# EasyEDA schematic soap-disp-20210518.json

## Sheets
1 Computer: TITLE: Sheet_1; REV: 1.0; Date: 2021-03-28; Sheet: 1/1; Drawn By: Suresh Kumar Gadi; Company: Your Company
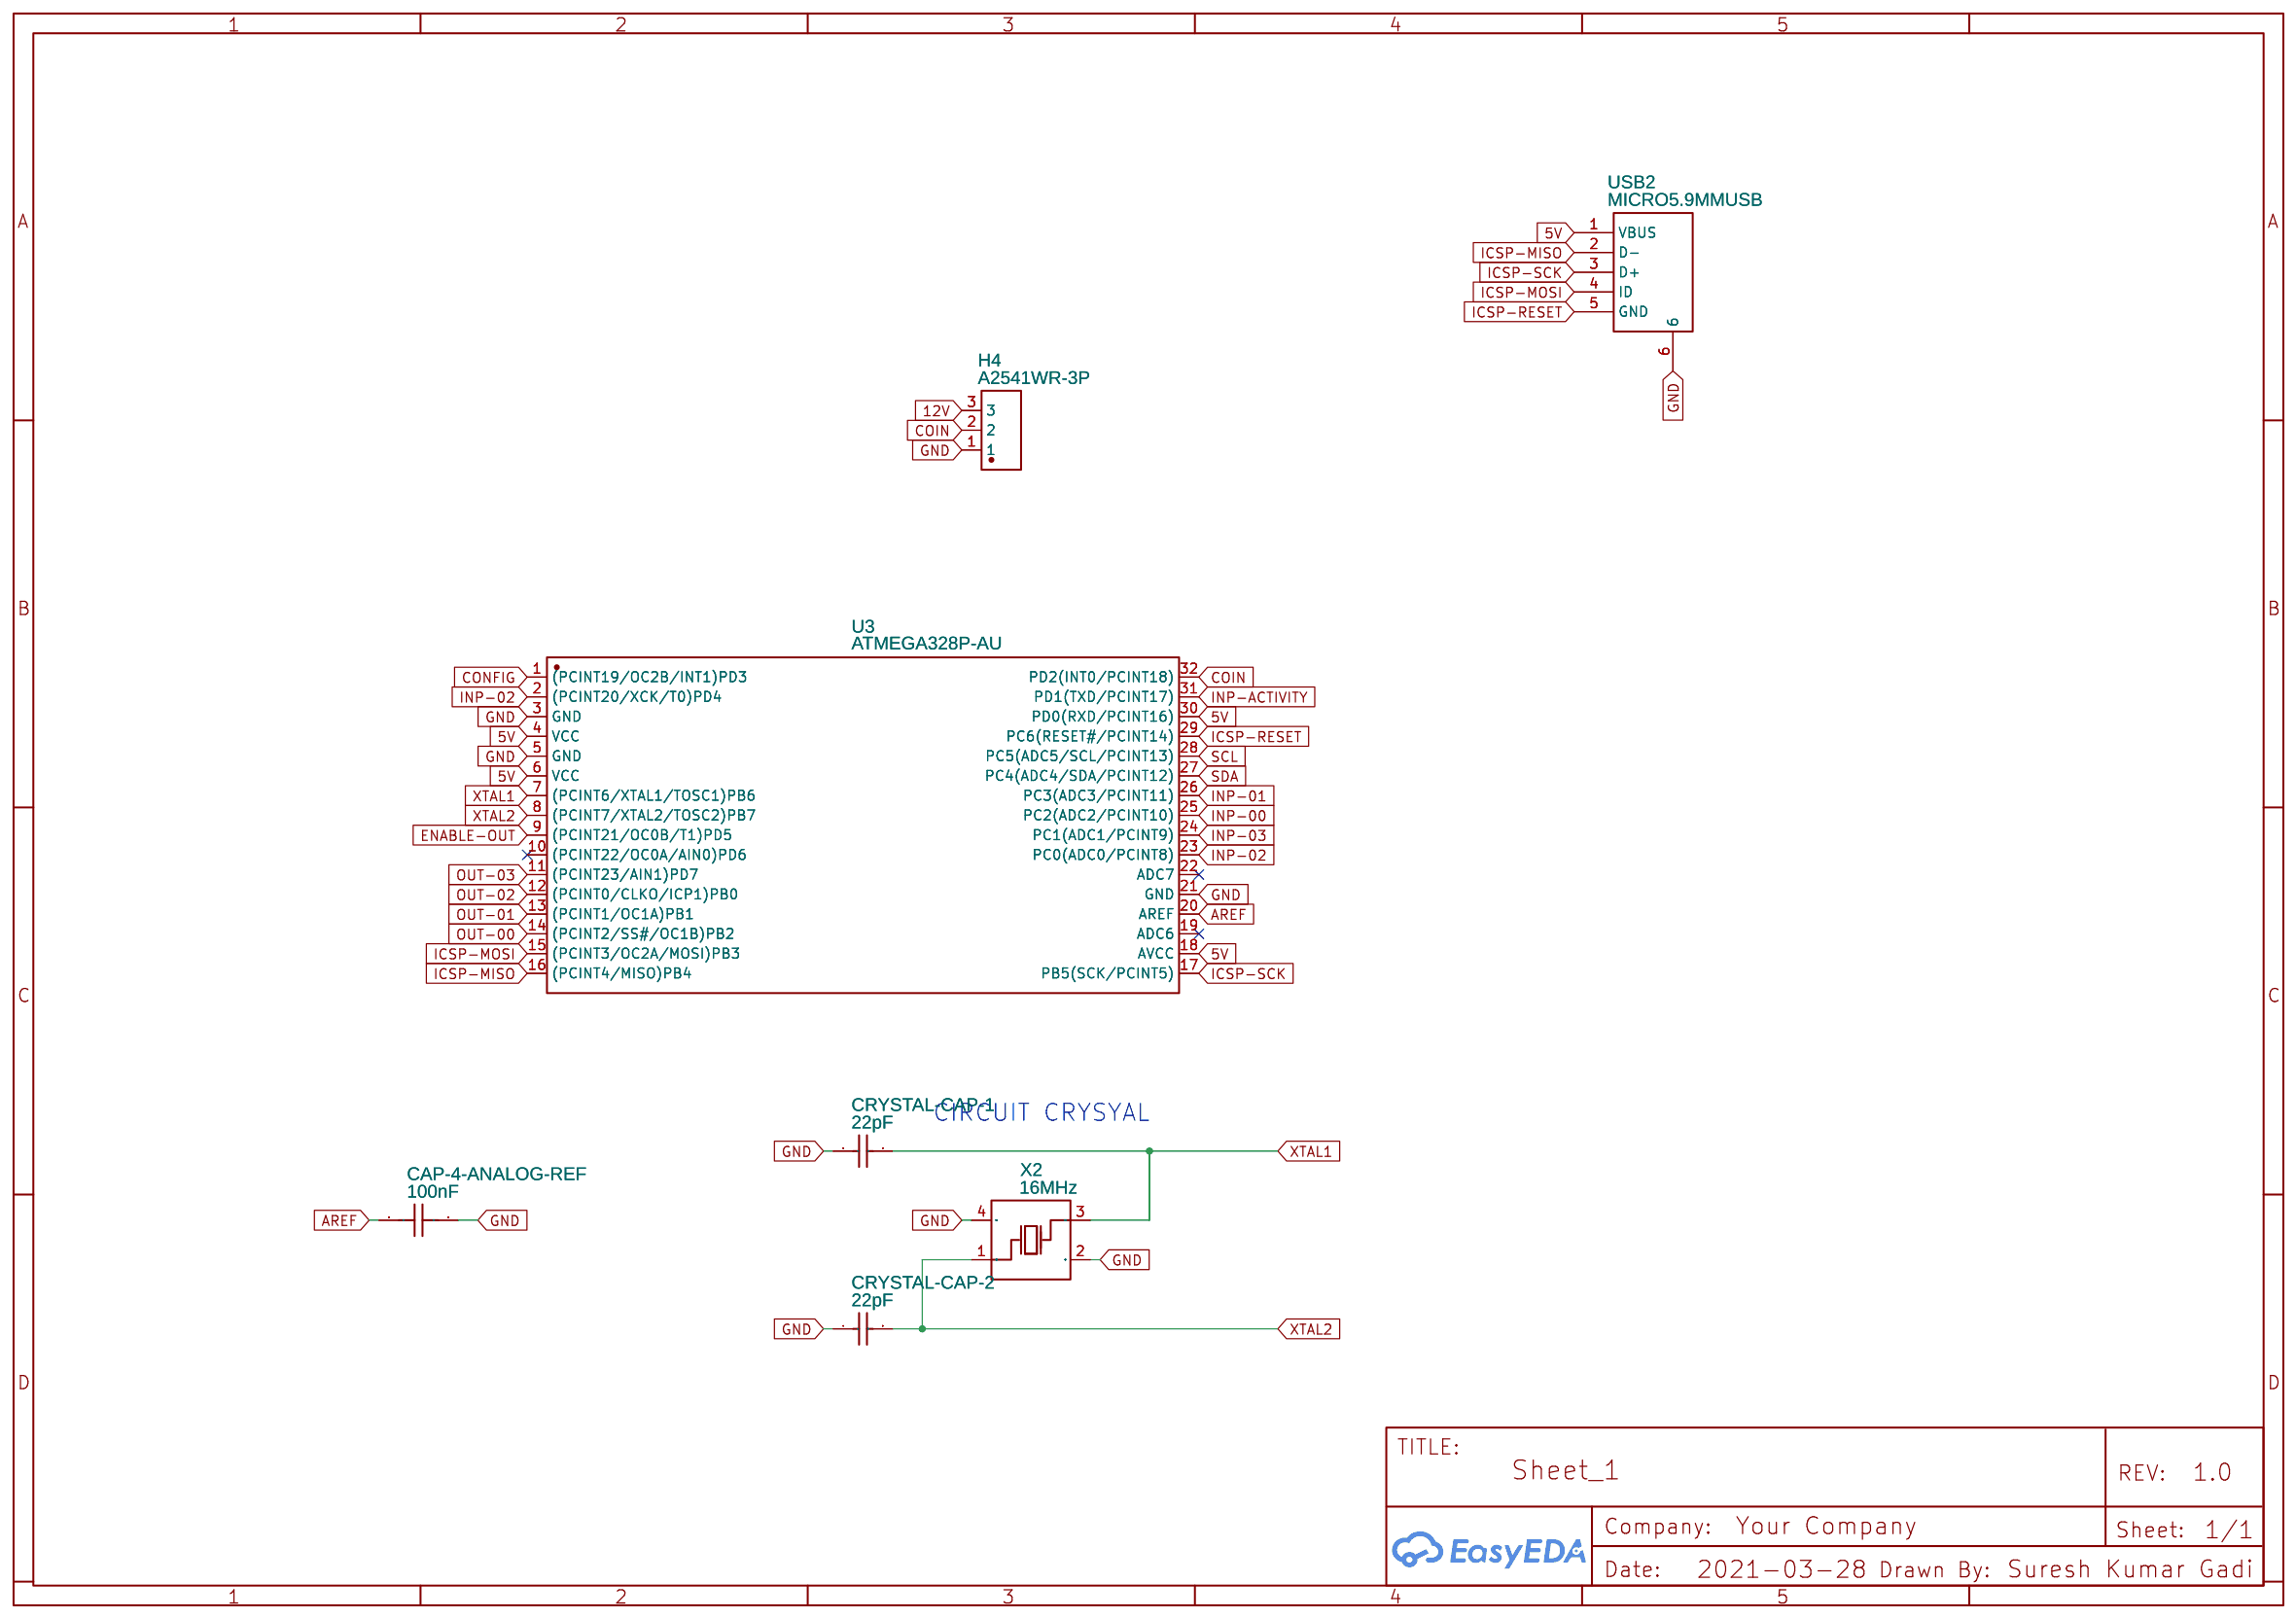
[diagram p0: Computer]
2 Relays: TITLE: Sheet_2
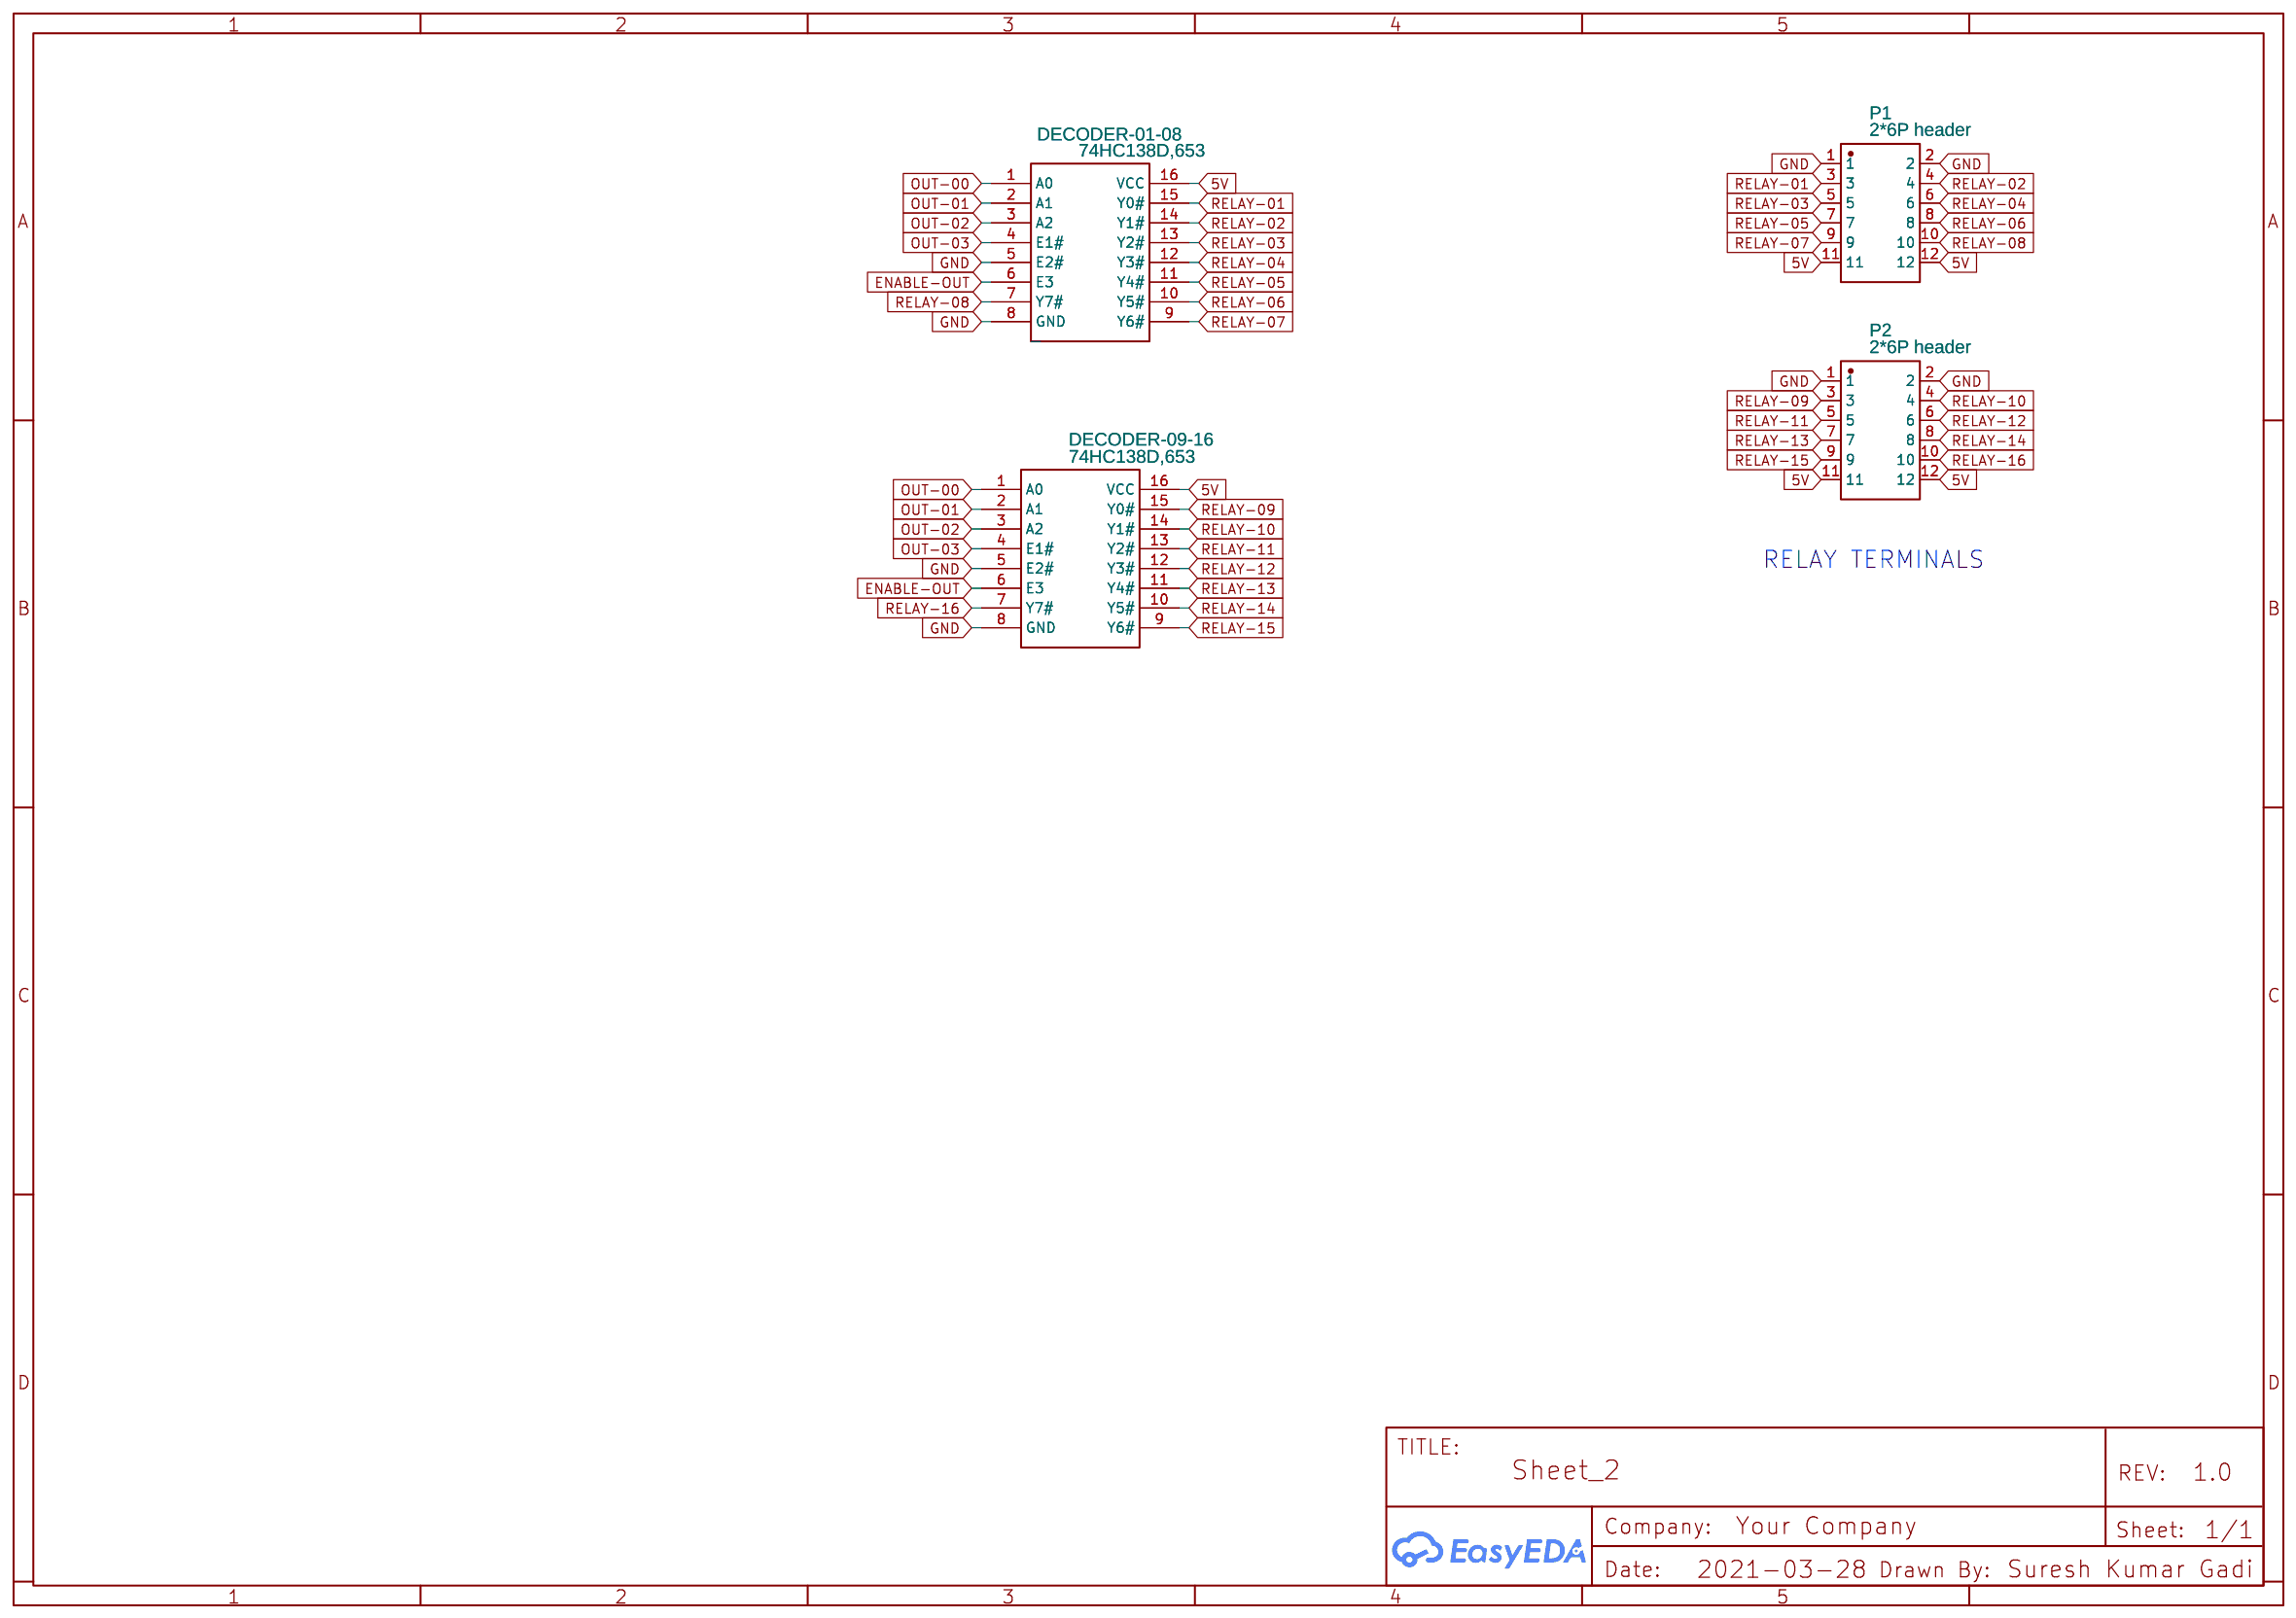
[diagram p1: Relays]
3 Buttons: TITLE: Sheet_2
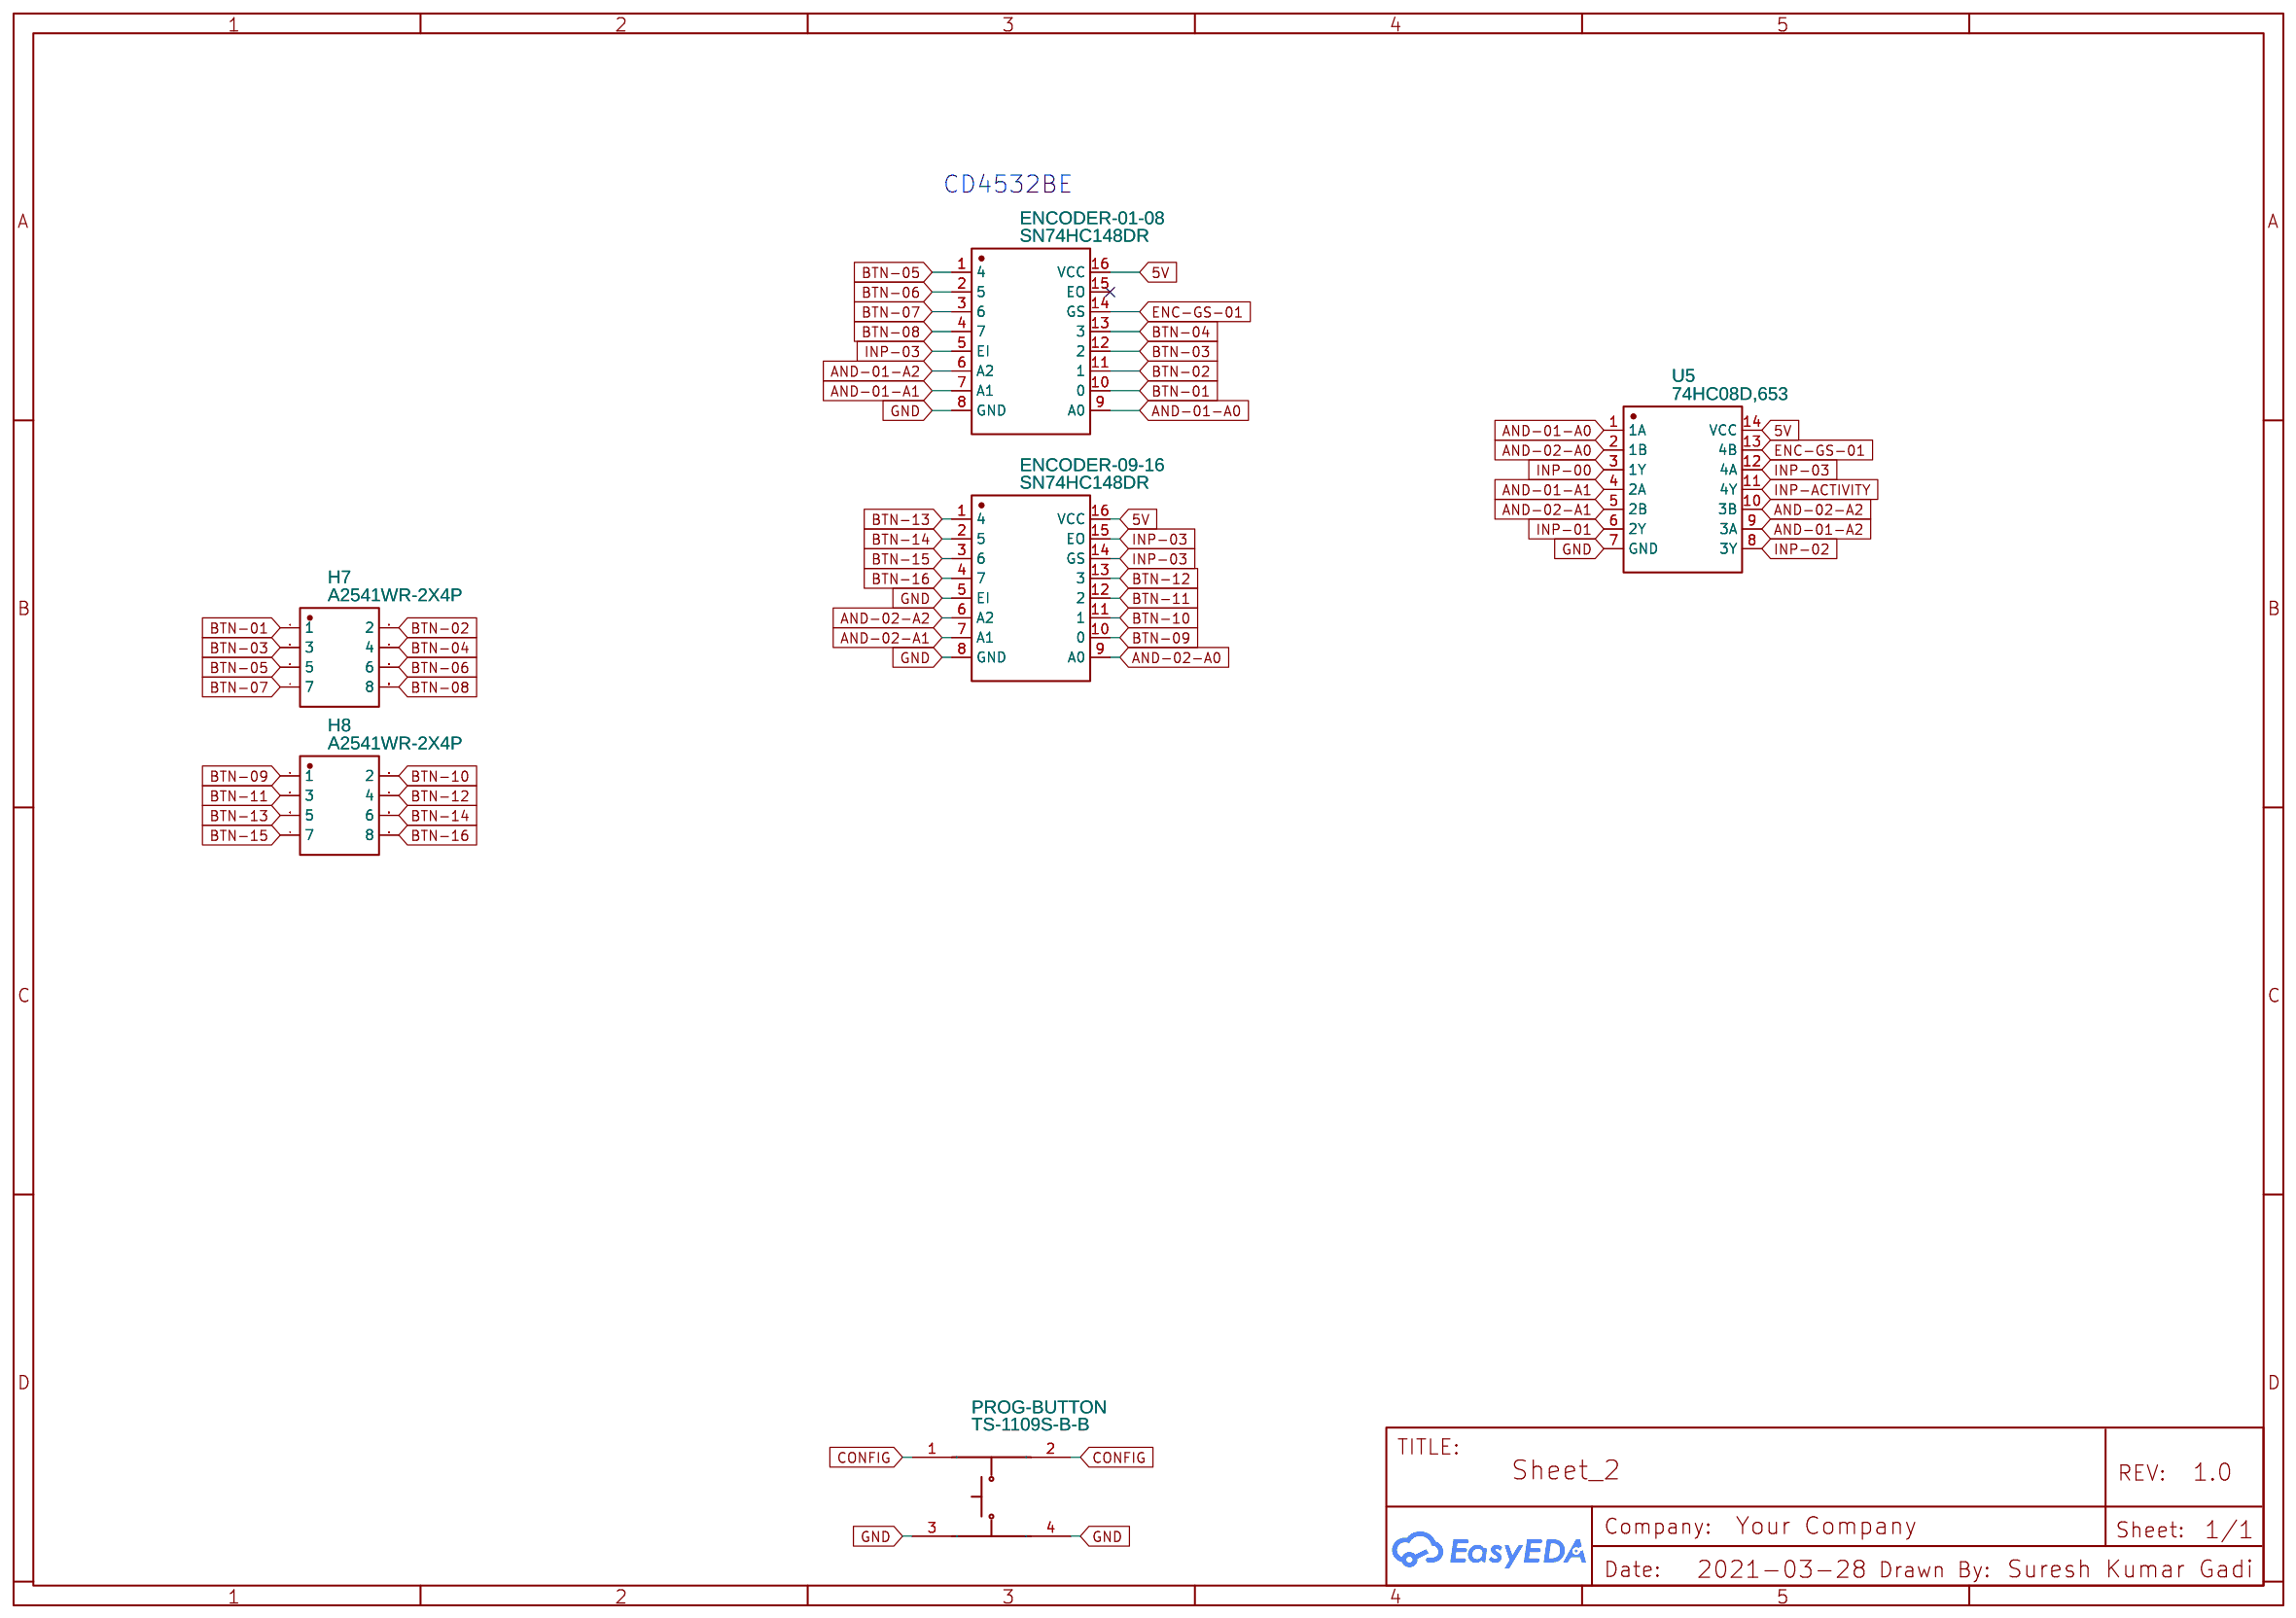
[diagram p2: Buttons]
4 Power: TITLE: Sheet_2
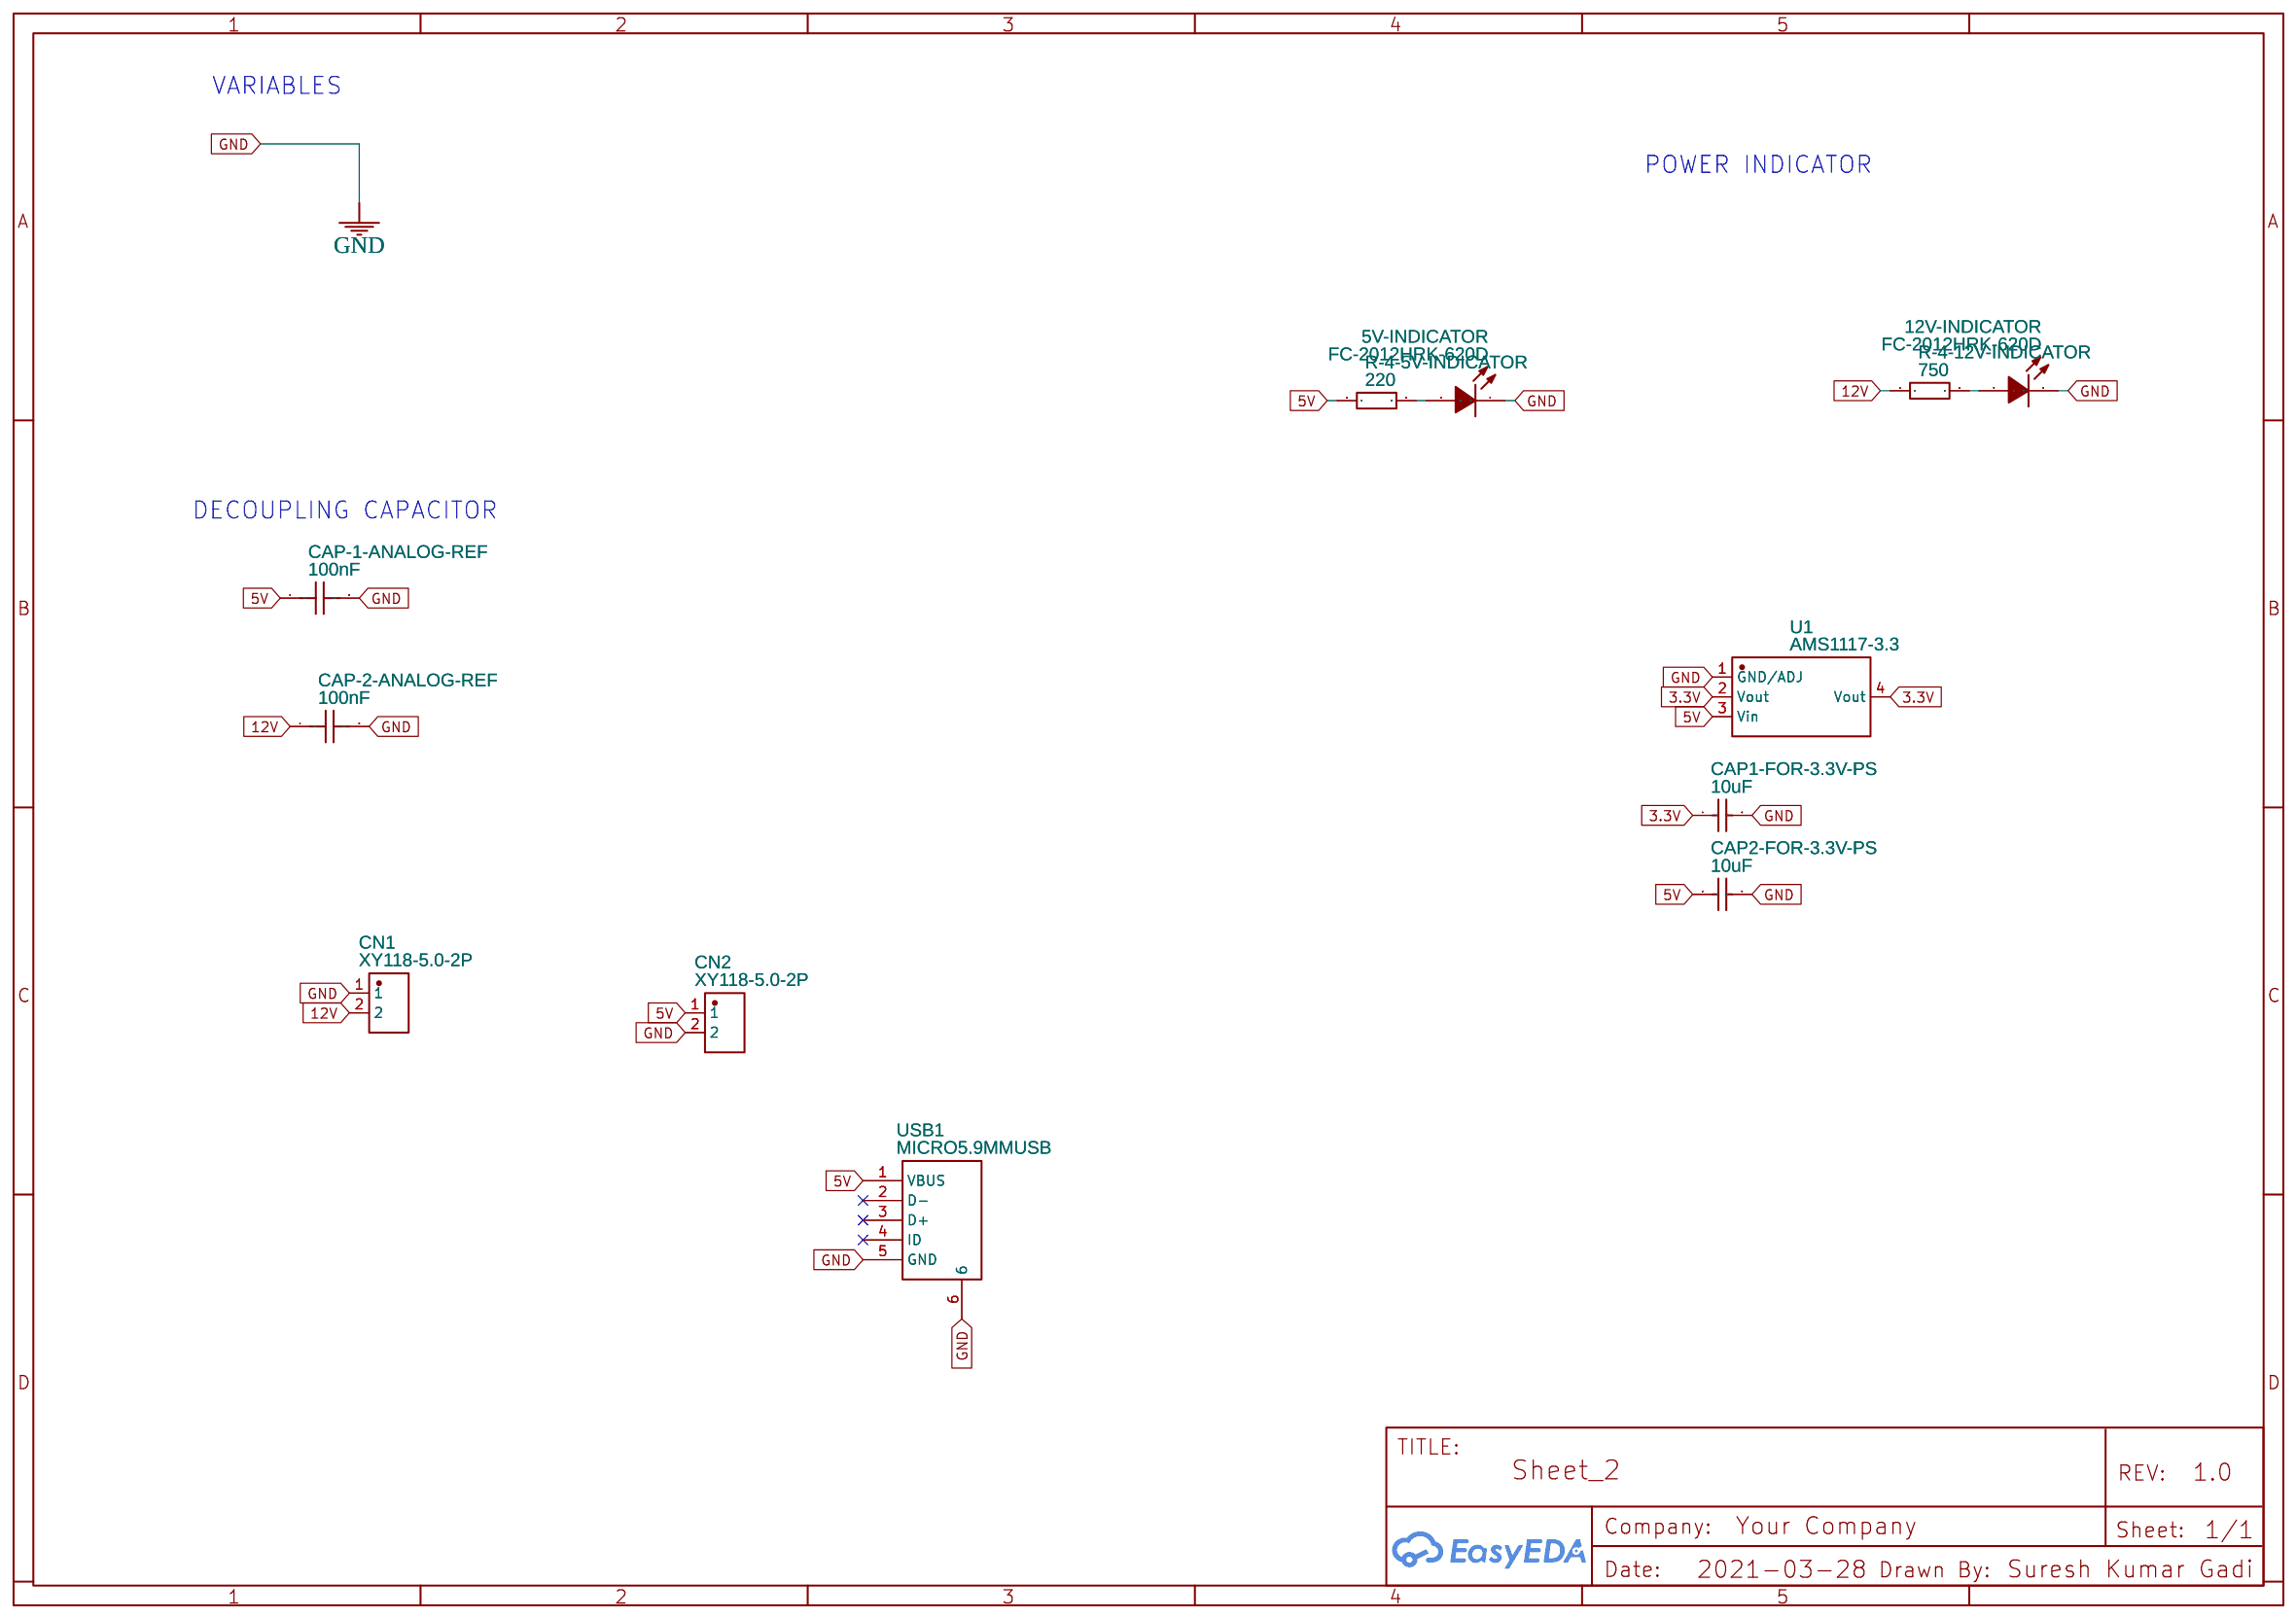
[diagram p3: Power]
5 Pull up-down: Date: 2021-03-29
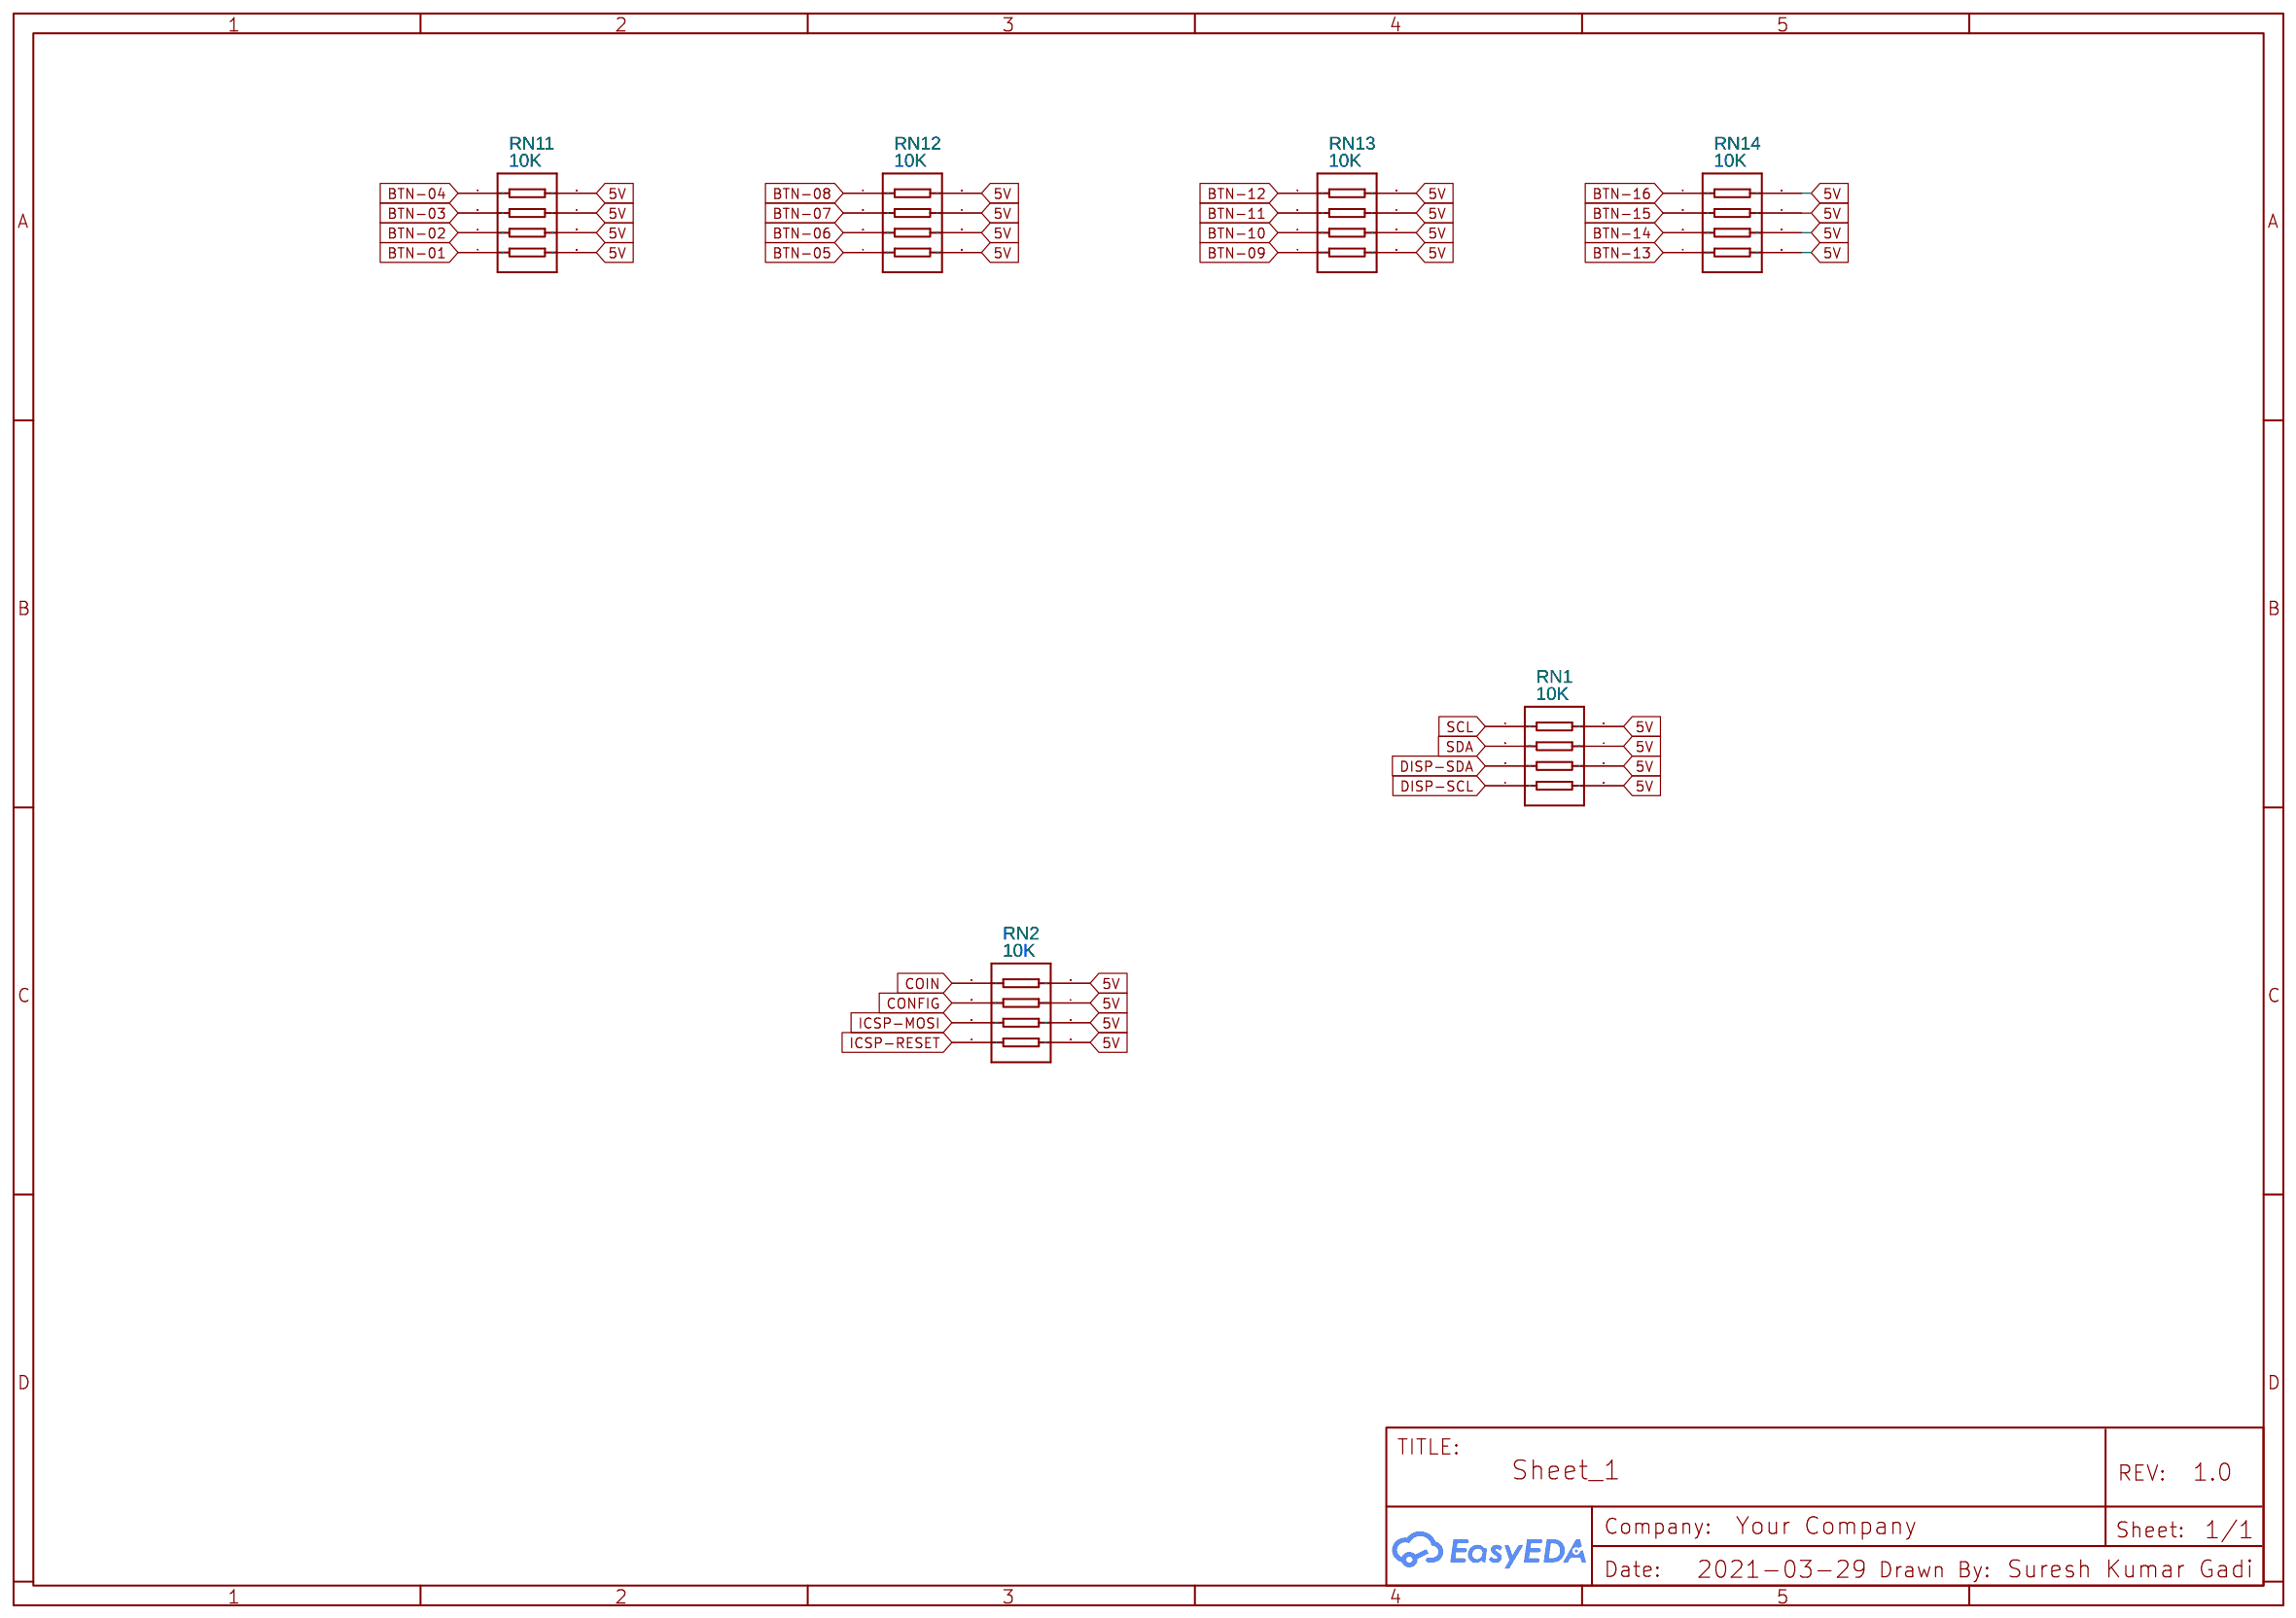
[diagram p4: Pull up-down]
6 SD Card: Date: 2021-04-14
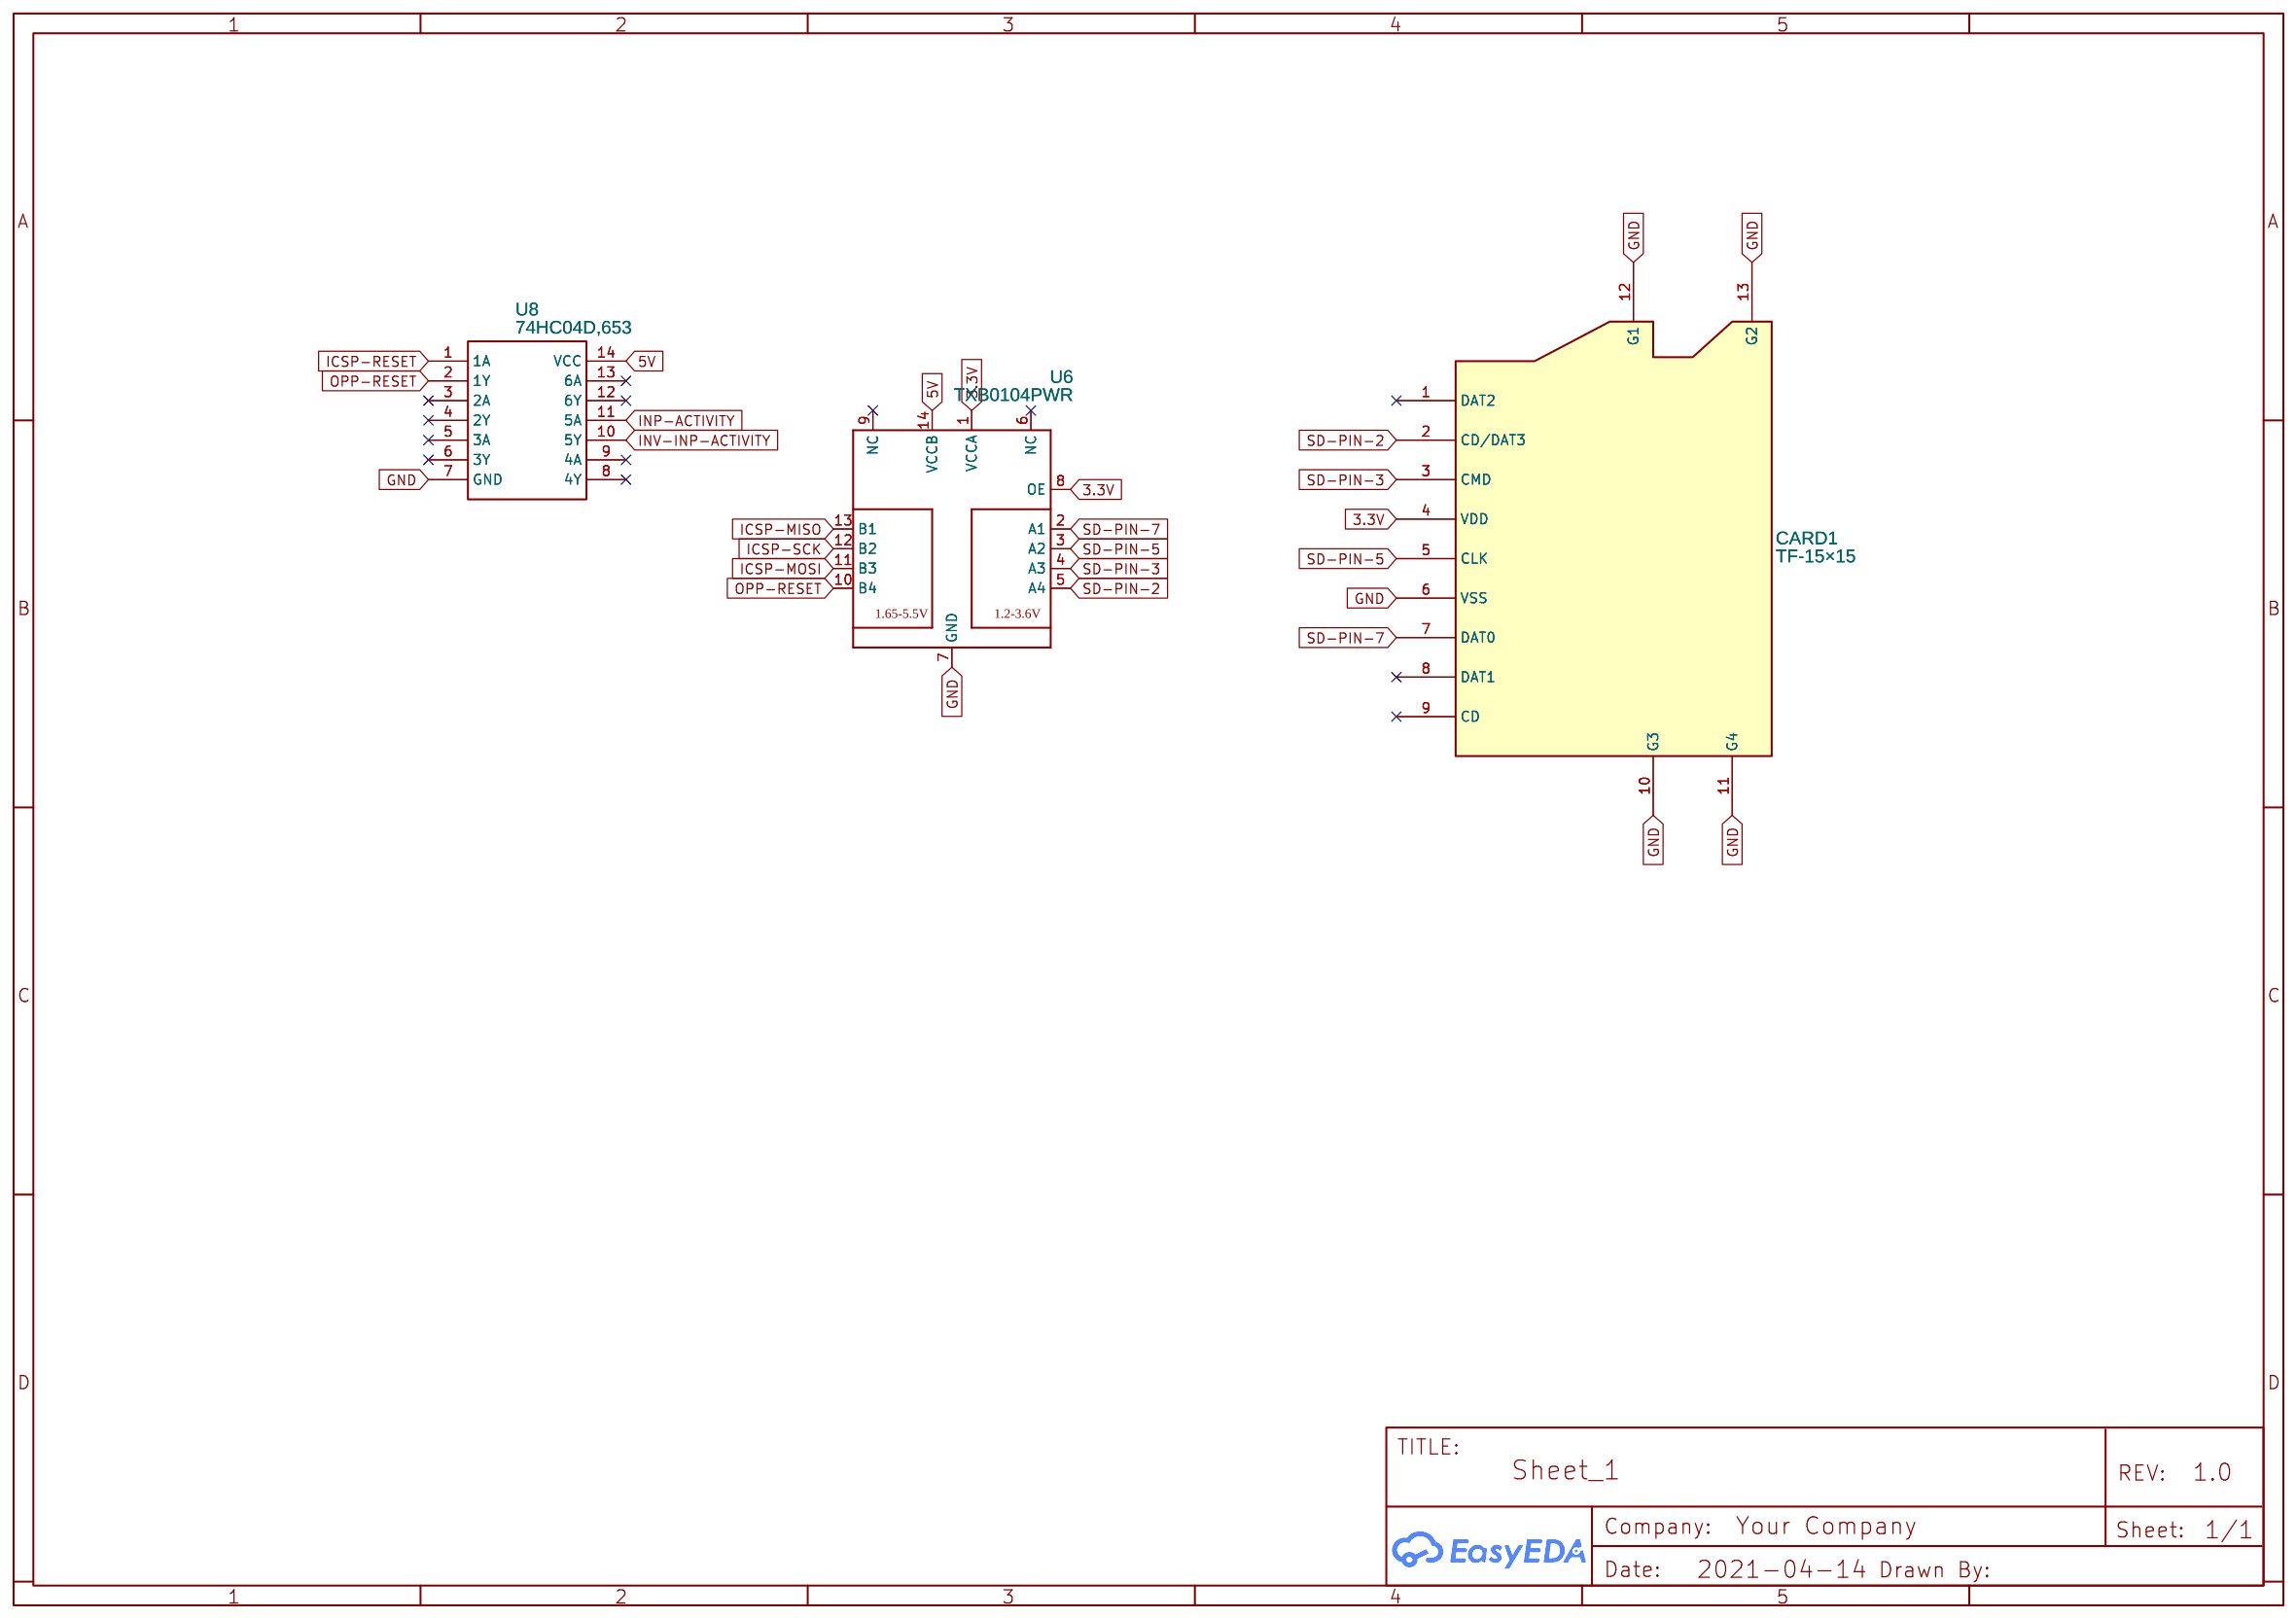
[diagram p5: SD Card]
7 Capacitor: Date: 2021-05-07
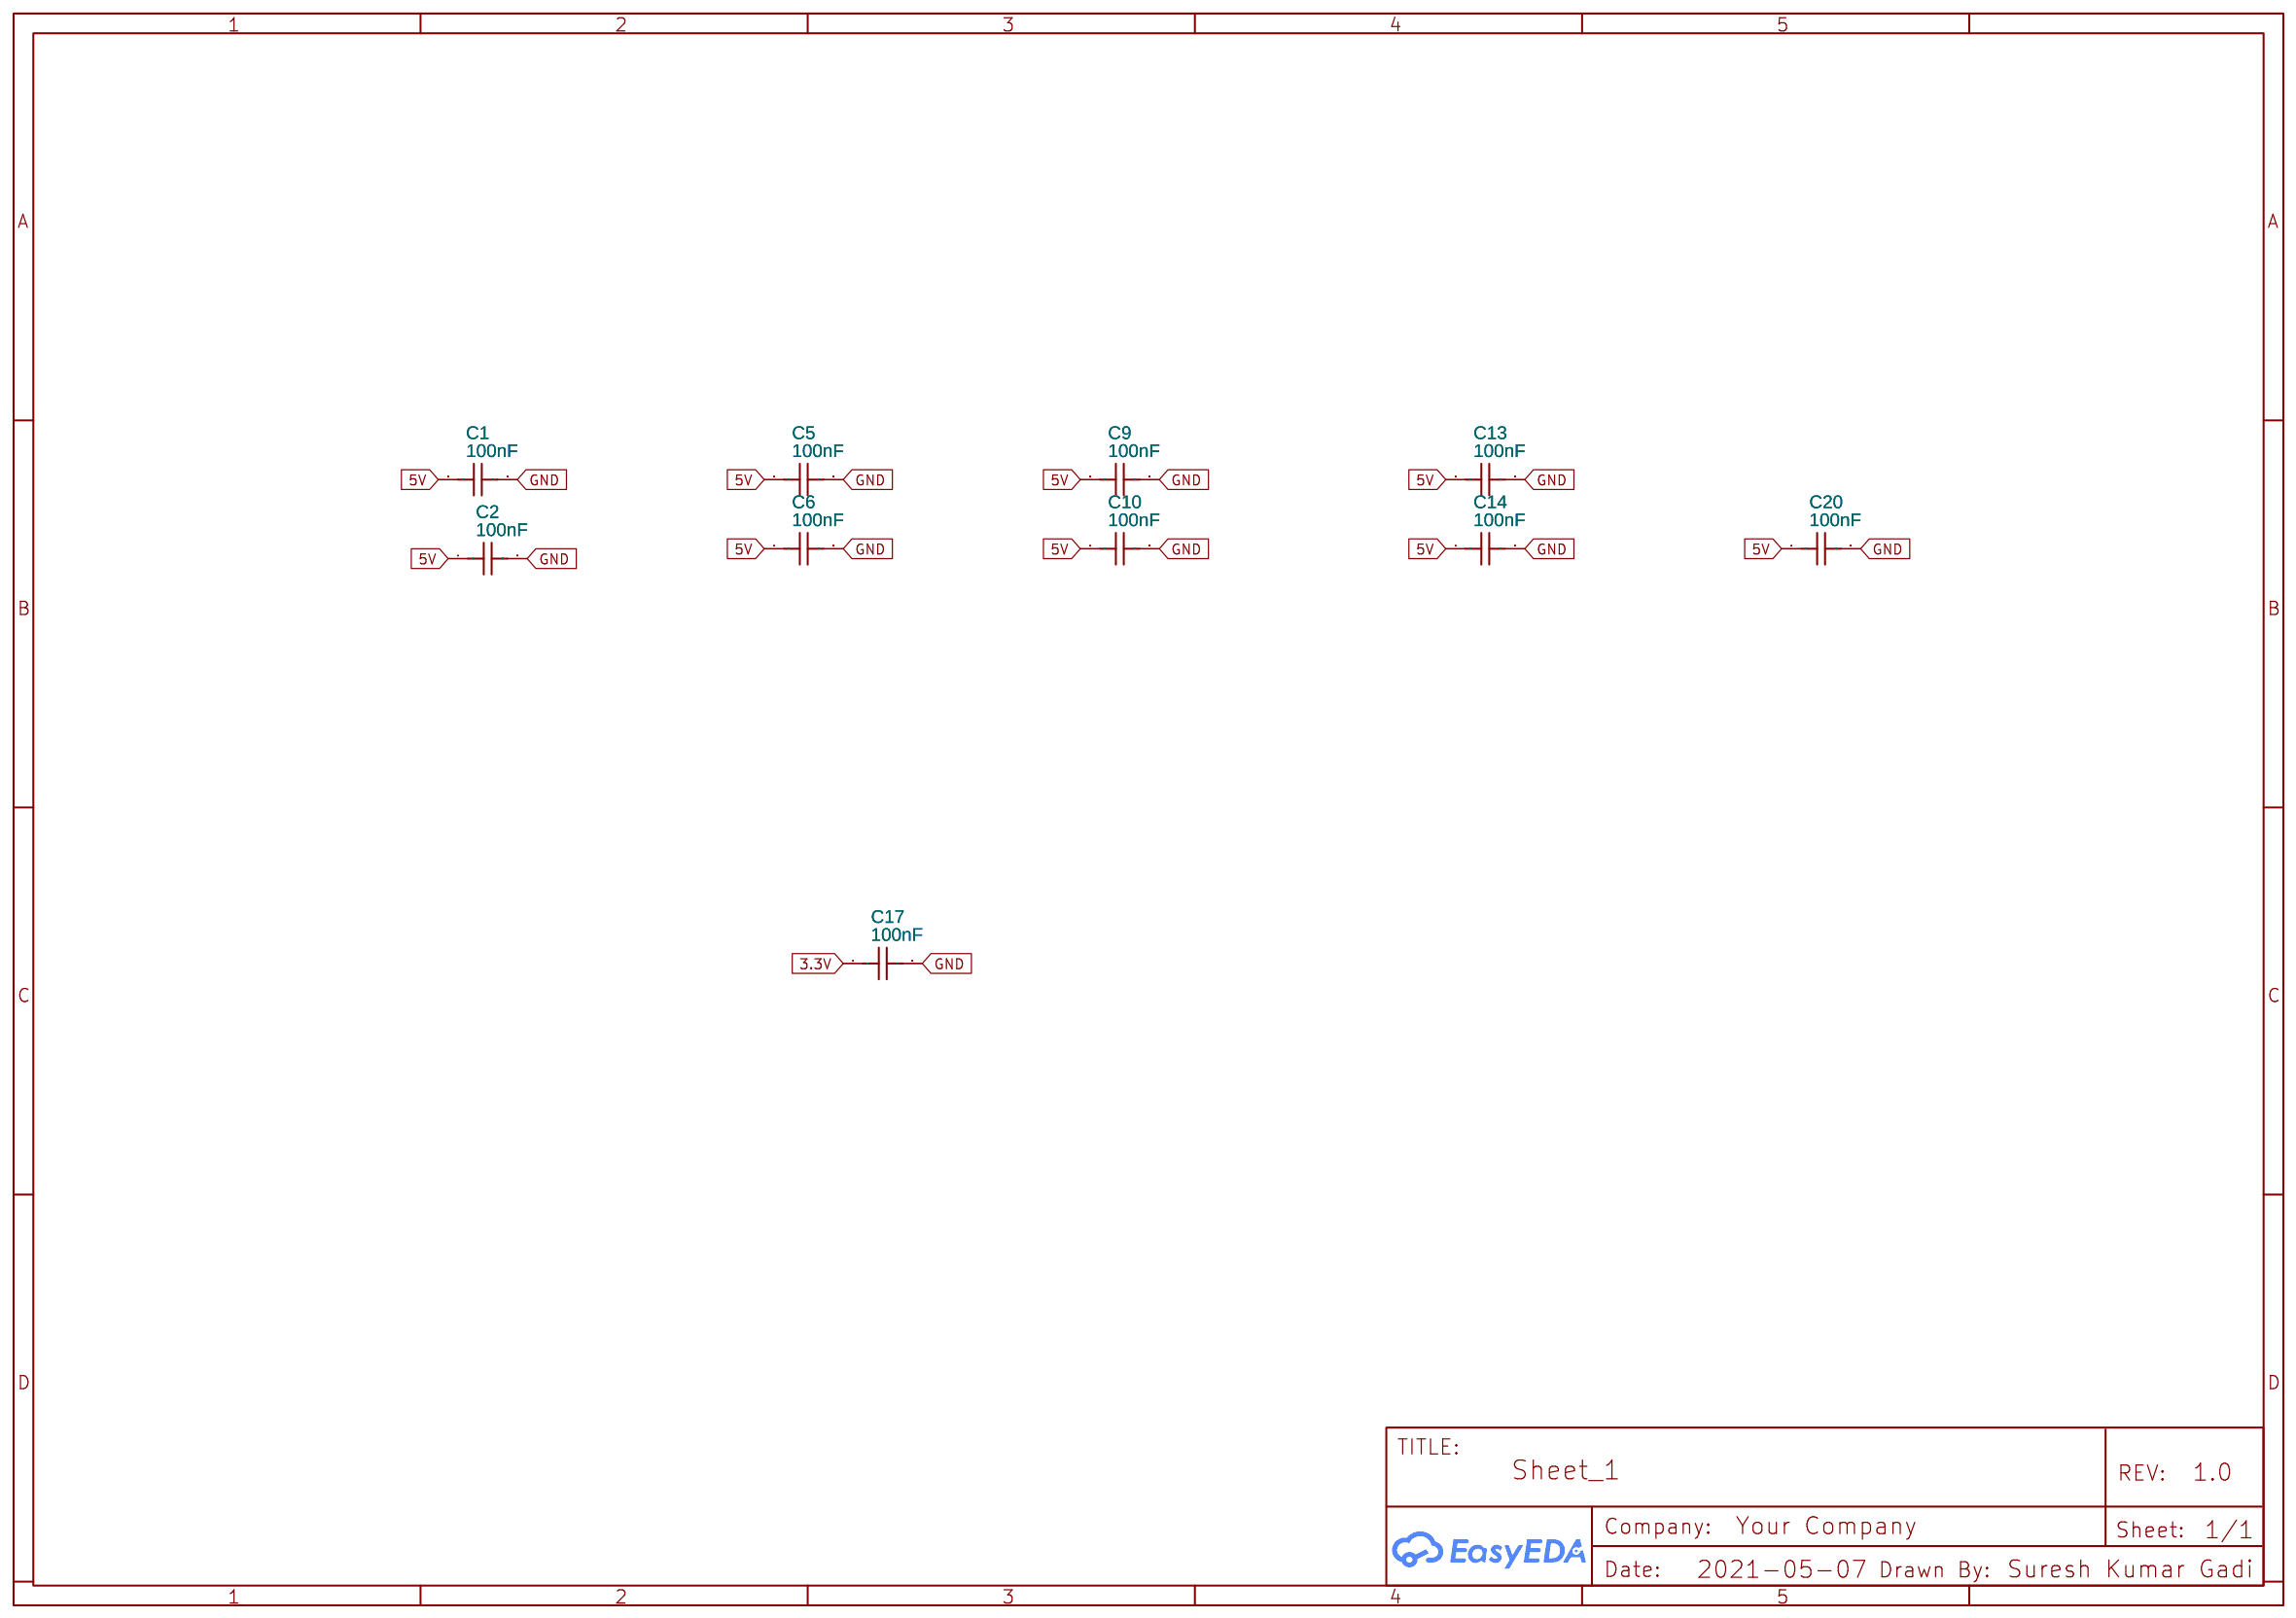
[diagram p6: Capacitor]
8 Display: Date: 2021-05-09
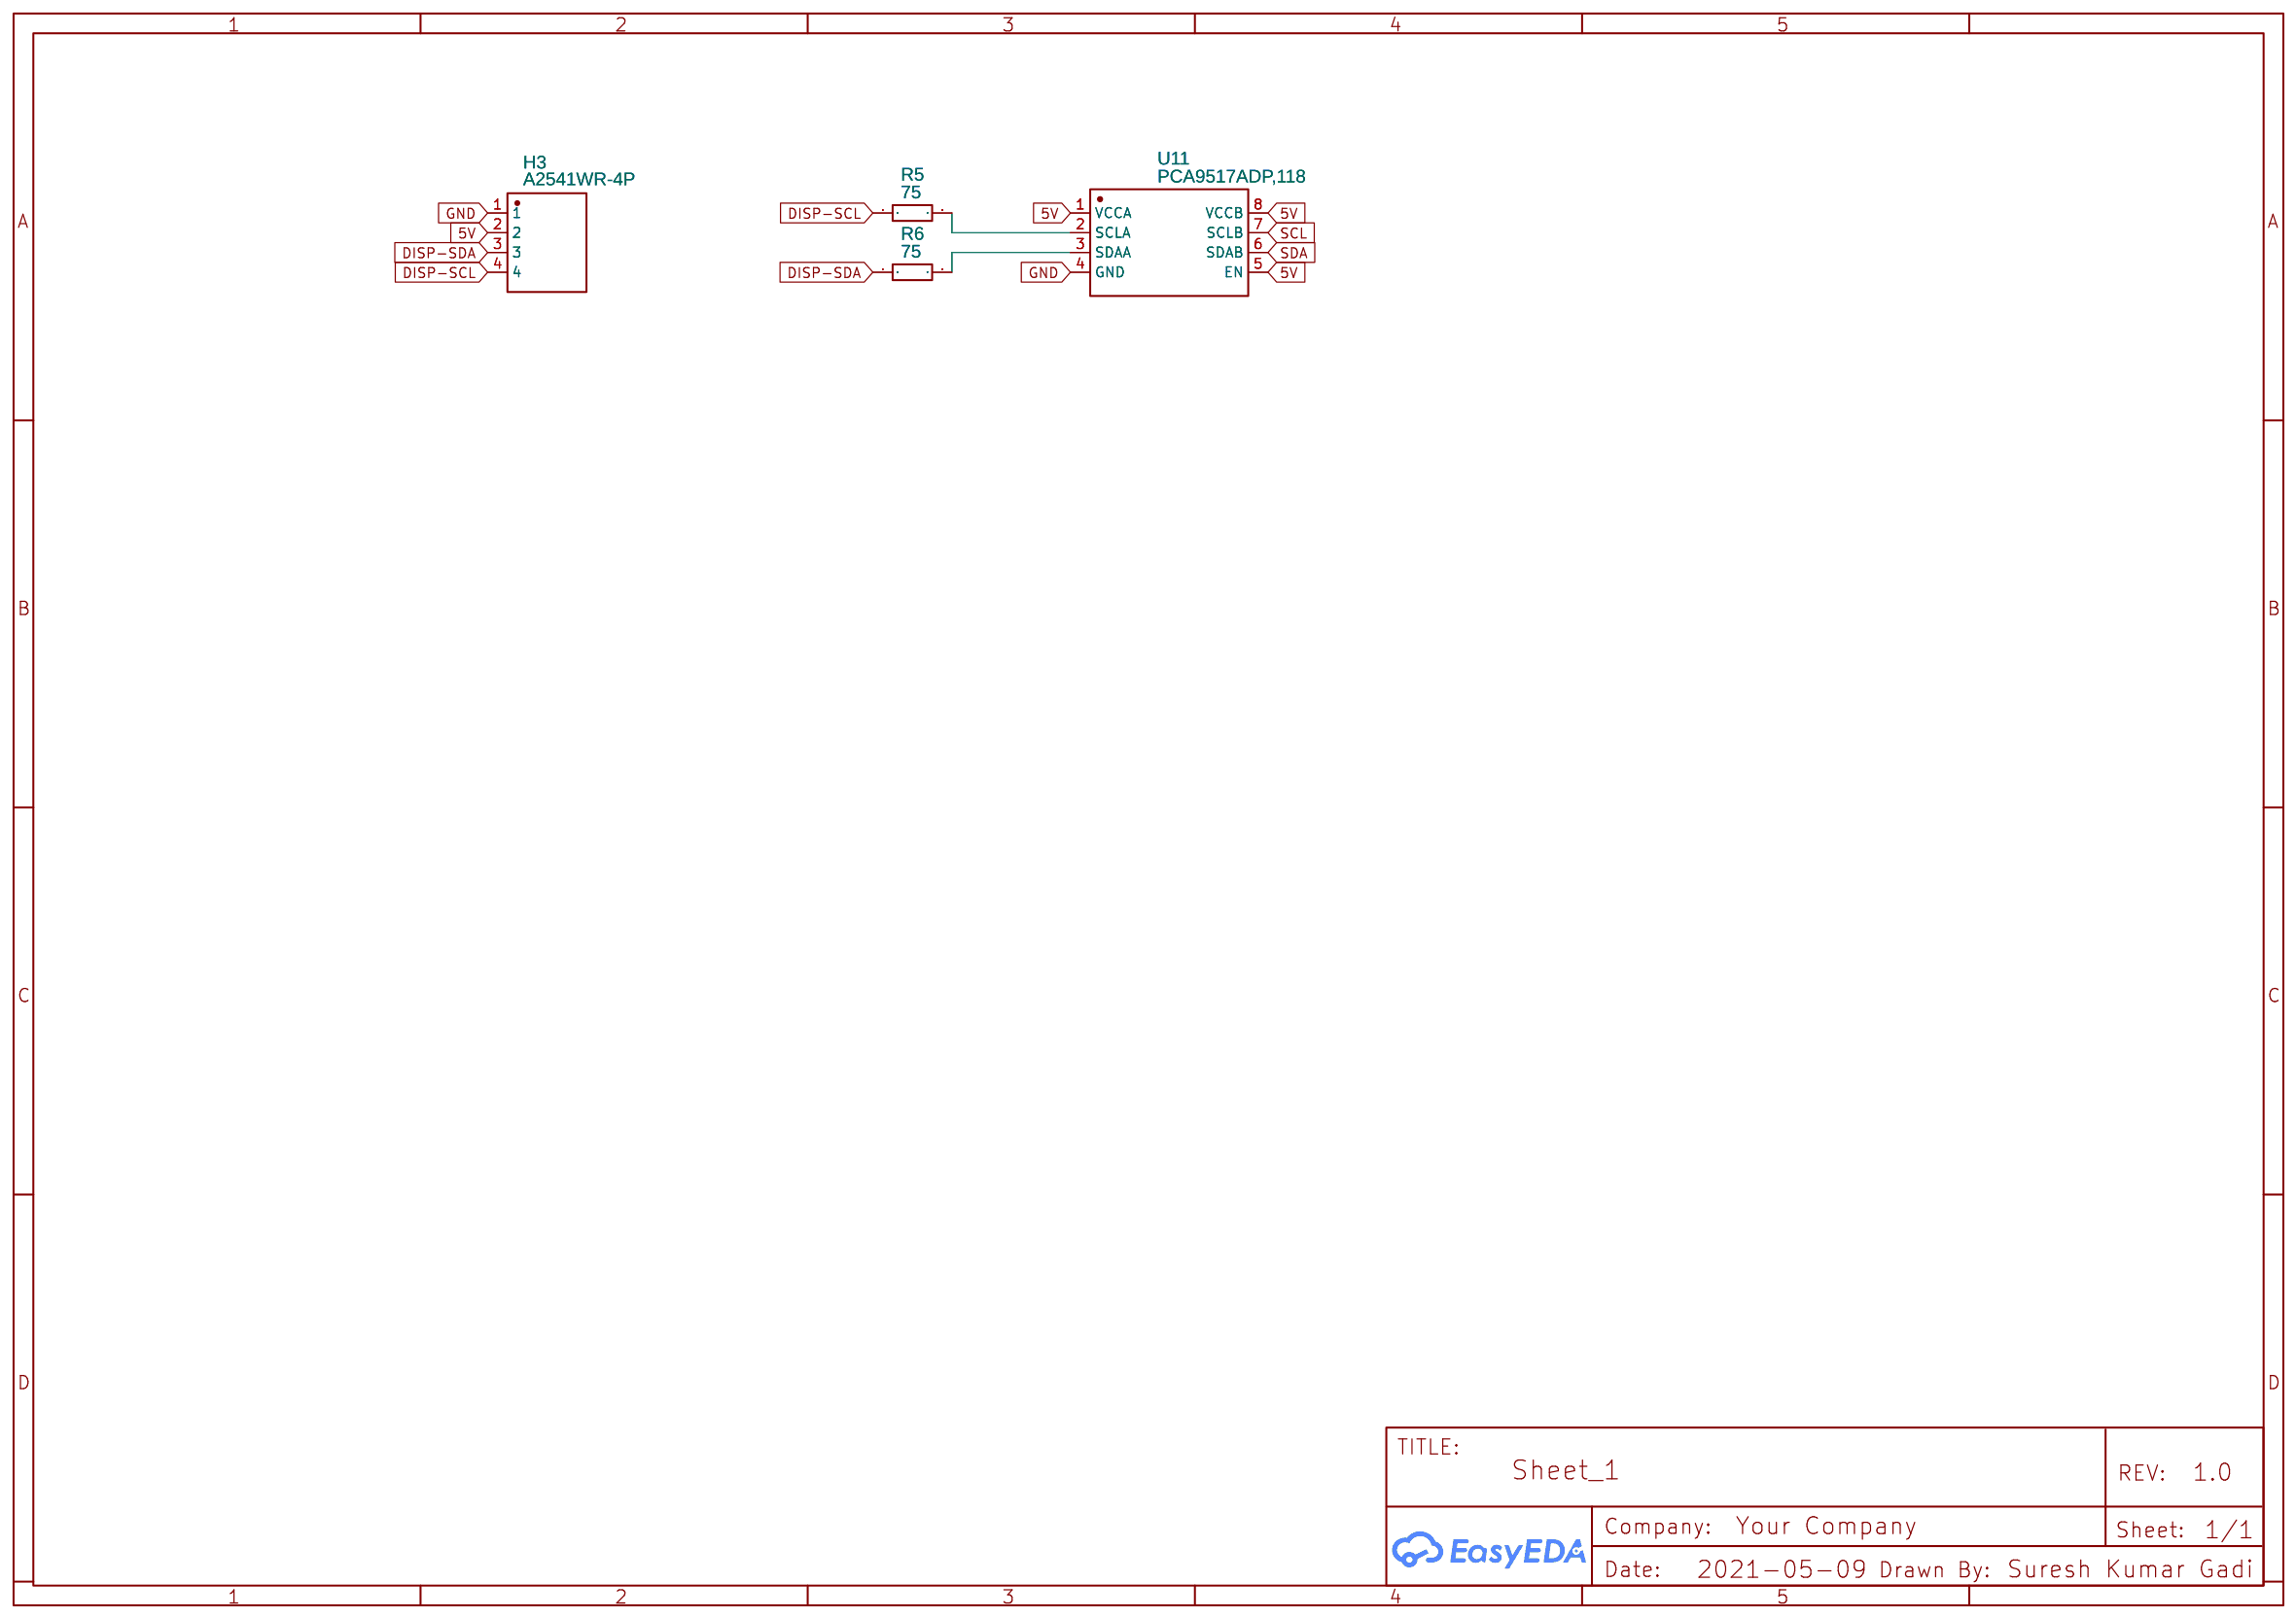
[diagram p7: Display]
9 LEDs: Date: 2021-05-09
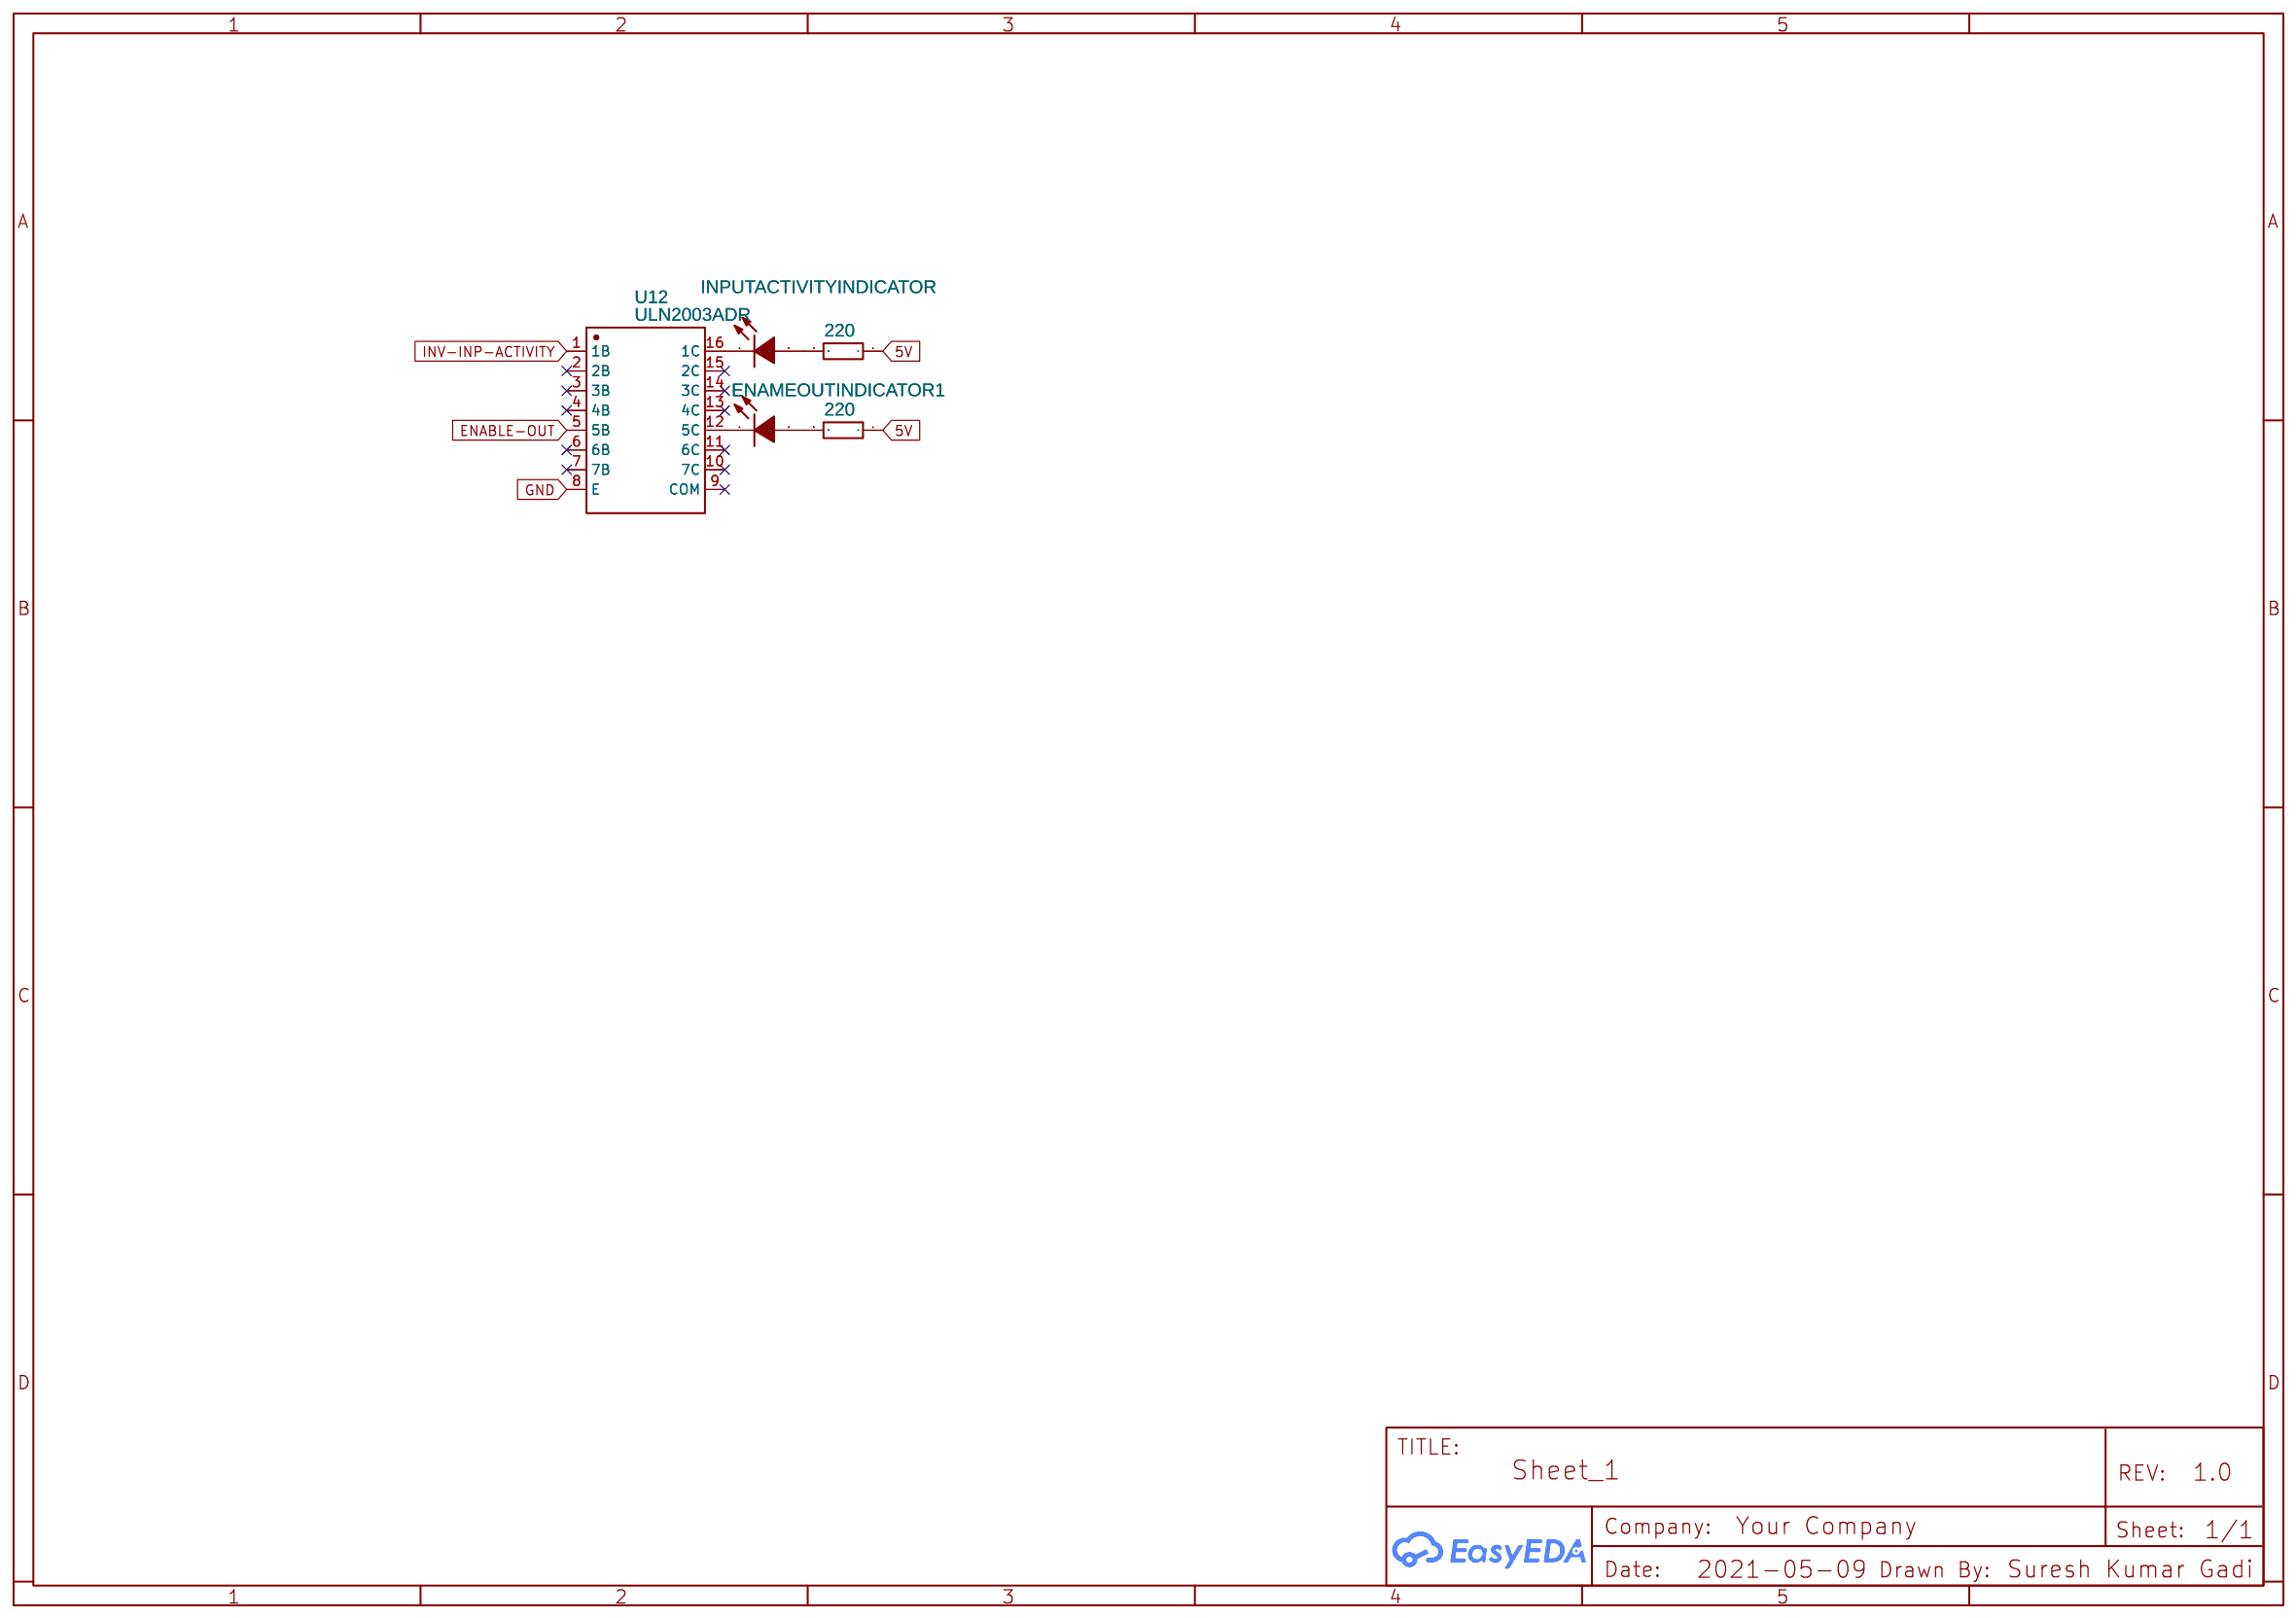
[diagram p8: LEDs]

## Parts
sheet Buttons
ENCODER-01-08  SN74HC148DR  [SOIC-16_L9.9-W3.9-P1.27-LS6.0-BL]
ENCODER-09-16  SN74HC148DR  [SOIC-16_L9.9-W3.9-P1.27-LS6.0-BL]
H7  A2541WR-2X4P  [HDR-TH_8P-P2.54-H-R2-C4-S2.54-W10.0_A2541WR]
H8  A2541WR-2X4P  [HDR-TH_8P-P2.54-H-R2-C4-S2.54-W10.0_A2541WR]
PROG-BUTTON  TS-1109S-B-B  [SW-SMD_4P-L4.5-W4.5-P3.00-LS7.0]
U5  74HC08D,653  [SOIC-14_L8.7-W3.9-P1.27-LS6.0-BL]
sheet Capacitor
C1  100nF  [C0603]
C2  100nF  [C0603]
C5  100nF  [C0603]
C6  100nF  [C0603]
C9  100nF  [C0603]
C10  100nF  [C0603]
C13  100nF  [C0603]
C14  100nF  [C0603]
C17  100nF  [C0603]
C20  100nF  [C0603]
sheet Computer
CAP-4-ANALOG-REF  100nF  [C0603]
CRYSTAL-CAP-1  22pF  [C0805]
CRYSTAL-CAP-2  22pF  [C0805]
H4  A2541WR-3P  [HDR-TH_3P-P2.54-H-W10.0]
U3  ATMEGA328P-AU  [TQFP-32_L7.0-W7.0-P0.80-LS9.0-BL]
USB2  MICRO5.9MMUSB  [MICRO-USB-SMD_5P-P0.65-H-F_MICRO5.9MMUSB]
X2  16MHz  [OSC-SMD_4P-L3.2-W2.5-BL]
sheet Display
H3  A2541WR-4P  [HDR-TH_4P-P2.54-H-W10.3]
R5  75  [R0402]
R6  75  [R0402]
U11  PCA9517ADP,118  [TSSOP-8_L3.0-W3.0-P0.65-LS4.9-BL]
sheet LEDs
ENAMEOUTINDICATOR1  FC-2012HRK-620D  [LED0805-RD]
INPUTACTIVITYINDICATOR  FC-2012HRK-620D  [LED0805-RD]
R-4-1V-INDICATOR  220  [R0805]
RESFORENAMEOUTINDICATOR1  220  [R0805]
U12  ULN2003ADR  [SOIC-16_L9.9-W3.9-P1.27-LS6.0-BL]
sheet Power
5V-INDICATOR  FC-2012HRK-620D  [LED0805-RD]
12V-INDICATOR  FC-2012HRK-620D  [LED0805-RD]
CAP1-FOR-3.3V-PS  10uF  [C0805]
CAP2-FOR-3.3V-PS  10uF  [C0805]
CAP-1-ANALOG-REF  100nF  [C0603]
CAP-2-ANALOG-REF  100nF  [C0603]
CN1  XY118-5.0-2P  [CONN-TH_XY118-5.0-2P]
CN2  XY118-5.0-2P  [CONN-TH_XY118-5.0-2P]
R-4-5V-INDICATOR  220  [R0805]
R-4-12V-INDICATOR  750  [R1206]
U1  AMS1117-3.3  [SOT-223-3_L6.5-W3.4-P2.30-LS7.0-BR]
USB1  MICRO5.9MMUSB  [MICRO-USB-SMD_5P-P0.65-H-F_MICRO5.9MMUSB]
sheet Pull up-down
RN1  10K  [RES-ARRAY-SMD_0603-8P-L3.2-W1.6-BL]
RN2  10K  [RES-ARRAY-SMD_0603-8P-L3.2-W1.6-BL]
RN11  10K  [RES-ARRAY-SMD_0603-8P-L3.2-W1.6-BL]
RN12  10K  [RES-ARRAY-SMD_0603-8P-L3.2-W1.6-BL]
RN13  10K  [RES-ARRAY-SMD_0603-8P-L3.2-W1.6-BL]
RN14  10K  [RES-ARRAY-SMD_0603-8P-L3.2-W1.6-BL]
sheet Relays
DECODER-01-08  74HC138D,653  [SOIC-16_L9.9-W3.9-P1.27-LS6.0-BL]
DECODER-09-16  74HC138D,653  [SOIC-16_L9.9-W3.9-P1.27-LS6.0-BL]
P1  2*6P header  [HDR-TH_12P-P2.54-H-R2-C6-S2.54]
P2  2*6P header  [HDR-TH_12P-P2.54-H-R2-C6-S2.54]
sheet SD Card
CARD1  TF-15×15  [TF-SMD_TF-15-15]
U6  TXB0104PWR  [TSSOP-14_L5.0-W4.4-P0.65-LS6.4-BL]
U8  74HC04D,653  [SOIC-14_L8.7-W3.9-P1.27-LS6.0-BL]

## Library data of the parts
ENCODER-01-08 ENCODER-09-16 = SN74HC148DR: Supplier: LCSC; Manufacturer: TI; Supplier Part: C6819; SMT Type: Extend; JLCPCB SMD: Yes; LCSC Assembly: Yes; Paste Type: expand
H7 H8 = A2541WR-2X4P: Supplier: LCSC; Supplier Part: C239335; Manufacturer: Changjiang Connectors; Manufacturer Part: A2541WR-2x4P; Contributor: LCSC; link: https://item.szlcsc.com/238439.html?ref=editor&logined=true; LCSC Assembly: Yes; SMT Type: Extend; Paste Type: expand
PROG-BUTTON = TS-1109S-B-B: Supplier: LCSC; Supplier Part: C480315; Manufacturer: XKB Enterprise; Contributor: LCSC; SMT Type: Extend; JLCPCB SMD: Yes; Paste Type: recommend
U5 = 74HC08D,653: Supplier: LCSC; Manufacturer: Nexperia; image: //image.lceda.cn/szlcsc/C5593.jpg; Supplier Part: C5593; JLCPCB Part Class: Basic Part
C1 C2 C5 C6 C9 C10 C13 C14 C17 C20 = CC0603KRX7R9BB104: Supplier: LCSC; Manufacturer: YAGEO; Supplier Part: C14663; JLCPCB Part Class: Basic Part
CAP-1-ANALOG-REF CAP-2-ANALOG-REF CAP-4-ANALOG-REF = CC0603KRX7R9BB104: Supplier: LCSC; Manufacturer: YAGEO; Supplier Part: C14663; SMT Type: Basic; JLCPCB SMD: Yes; LCSC Assembly: Yes; Paste Type: base
CRYSTAL-CAP-1 CRYSTAL-CAP-2 = CL21C220JBANNNC: Supplier: LCSC; Manufacturer: SAMSUNG; Supplier Part: C1804; SMT Type: Basic; JLCPCB SMD: Yes; LCSC Assembly: Yes; Paste Type: base
H4 = A2541WR-3P: Supplier: LCSC; Supplier Part: C225489; Manufacturer: Changjiang Connectors; Contributor: LCSC; JLCPCB Part Class: Extended Part
U3 = ATMEGA328P-AU: Supplier: LCSC; Manufacturer: MICROCHIP; image: //image.lceda.cn/szlcsc/C14877.jpg; Supplier Part: C14877; SMT Type: Basic; JLCPCB SMD: Yes; LCSC Assembly: Yes; Paste Type: base
USB1 USB2 = MICRO5.9MMUSB: Supplier: LCSC; Supplier Part: C393940; Manufacturer: SHOU HAN; Manufacturer Part: MICRO5.9mmusb; Contributor: LCSC
X2 = X322516MLB4SI: Supplier: LCSC; Manufacturer: YXC; Supplier Part: C13738; SMT Type: Basic; JLCPCB SMD: Yes; LCSC Assembly: Yes; Paste Type: base
H3 = A2541WR-4P: Supplier: LCSC; Supplier Part: C225490; Manufacturer: Changjiang Connectors; Contributor: LCSC; JLCPCB Part Class: Extended Part
R5 R6 = 0402WGF750JTCE: Supplier: LCSC; Manufacturer: UniOhm; Supplier Part: C25133; JLCPCB Part Class: Basic Part
U11 = PCA9517ADP,118: Supplier: LCSC; Manufacturer: NXP; image: //image.lceda.cn/szlcsc/C80799.jpg; Supplier Part: C80799; JLCPCB Part Class: Extended Part
5V-INDICATOR 12V-INDICATOR ENAMEOUTINDICATOR1 INPUTACTIVITYINDICATOR = FC-2012HRK-620D: Supplier: LCSC; Manufacturer: NATIONSTAR; image: //image.lceda.cn/szlcsc/C84256.jpg; Supplier Part: C84256; SMT Type: Basic; JLCPCB SMD: Yes; LCSC Assembly: Yes; Paste Type: base
R-4-1V-INDICATOR R-4-5V-INDICATOR RESFORENAMEOUTINDICATOR1 = 0805W8F2200T5E: Supplier: LCSC; Manufacturer: UniOhm; Supplier Part: C17557; SMT Type: Basic; JLCPCB SMD: Yes; LCSC Assembly: Yes; Paste Type: base
U12 = ULN2003ADR: Supplier: LCSC; Manufacturer: TI; image: //image.lceda.cn/szlcsc/C7512.jpg; Supplier Part: C7512; JLCPCB Part Class: Basic Part
CAP1-FOR-3.3V-PS CAP2-FOR-3.3V-PS = CL21A106KAYNNNE: Supplier: LCSC; Manufacturer: SAMSUNG; Supplier Part: C15850; SMT Type: Basic; JLCPCB SMD: Yes; LCSC Assembly: Yes; Paste Type: base
CN1 CN2 = XY118-5.0-2P: Supplier: LCSC; Supplier Part: C784922; Manufacturer: Ningbo Xinlaiya Elec.; Contributor: LCSC; LCSC Assembly: Yes; SMT Type: Extend; Paste Type: expand
R-4-12V-INDICATOR = 1206W4F7500T5E: Supplier: LCSC; Manufacturer: UniOhm; Supplier Part: C17985; SMT Type: Basic; JLCPCB SMD: Yes; LCSC Assembly: Yes; Paste Type: base
U1 = AMS1117-3.3: sourceId: dwIGgezVh; Supplier: LCSC; Manufacturer: AMS; image: //image.lceda.cn/szlcsc/C6186.jpg; Supplier Part: C6186; SMT Type: Basic; JLCPCB SMD: Yes; LCSC Assembly: Yes; Paste Type: base
RN1 RN2 RN11-RN14 = 4D03WGJ0103T5E: Supplier: LCSC; Manufacturer: UniOhm; Supplier Part: C29718; SMT Type: Basic; JLCPCB SMD: Yes; LCSC Assembly: Yes; Paste Type: base
DECODER-01-08 DECODER-09-16 = 74HC138D,653: Supplier: LCSC; Manufacturer: Nexperia; image: //image.lceda.cn/szlcsc/C5602.jpg; Supplier Part: C5602; SMT Type: Basic; JLCPCB SMD: Yes; LCSC Assembly: Yes; Paste Type: base
P1 P2 = 2*6P header: Supplier: LCSC; Manufacturer: BOOMELE; image: //image.lceda.cn/szlcsc/C60565.jpg; Supplier Part: C60565; JLCPCB Part Class: Extended Part
CARD1 = TF-15×15: Supplier: LCSC; Manufacturer: SOFNG; Supplier Part: C111196
U6 = TXB0104PWR: Supplier: LCSC; Manufacturer: TI; Supplier Part: C60708; SMT Type: Extend; JLCPCB SMD: Yes; Paste Type: recommend
U8 = 74HC04D,653: Supplier: LCSC; Manufacturer: Nexperia; image: //image.lceda.cn/szlcsc/C5590.jpg; Supplier Part: C5590; SMT Type: Basic; JLCPCB SMD: Yes; LCSC Assembly: Yes; Paste Type: base

## Nets
3.3V: C17.1 CAP1-FOR-3.3V-PS.1 CARD1.4(VDD) U1.2(Vout) U1.4(Vout) U6.1(VCCA) U6.8(OE)
5V: C1.1 C2.1 C5.1 C6.1 C9.1 C10.1 C13.1 C14.1 C20.1 CAP2-FOR-3.3V-PS.1 CAP-1-ANALOG-REF.1 CN2.1 DECODER-01-08.16(VCC) DECODER-09-16.16(VCC) ENCODER-01-08.16(VCC) ENCODER-09-16.16(VCC) H3.2 P1.11 P1.12 P2.11 P2.12 R-4-1V-INDICATOR.1 R-4-5V-INDICATOR.1 RESFORENAMEOUTINDICATOR1.1 RN1.5 RN1.6 RN1.7 RN1.8 RN2.5 RN2.6 RN2.7 RN2.8 RN11.5 RN11.6 RN11.7 RN11.8 RN12.5 RN12.6 RN12.7 RN12.8 RN13.5 RN13.6 RN13.7 RN13.8 RN14.5 RN14.6 RN14.7 RN14.8 U1.3(Vin) U3.4(VCC) U3.6(VCC) U3.18(AVCC) U3.30(PD0(RXD/PCINT16)) U5.14(VCC) U6.14(VCCB) U8.14(VCC) U11.1(VCCA) U11.5(EN) U11.8(VCCB) USB1.1(VBUS) USB2.1(VBUS)
12V: CAP-2-ANALOG-REF.1 CN1.2 H4.3 R-4-12V-INDICATOR.1
GND: 5V-INDICATOR.1(-) 12V-INDICATOR.1(-) C1.2 C2.2 C5.2 C6.2 C9.2 C10.2 C13.2 C14.2 C17.2 C20.2 CAP1-FOR-3.3V-PS.2 CAP2-FOR-3.3V-PS.2 CAP-1-ANALOG-REF.2 CAP-2-ANALOG-REF.2 CAP-4-ANALOG-REF.2 CARD1.6(VSS) CARD1.10(G3) CARD1.11(G4) CARD1.12(G1) CARD1.13(G2) CN1.1 CN2.2 CRYSTAL-CAP-1.1 CRYSTAL-CAP-2.1 DECODER-01-08.5(E2#) DECODER-01-08.8(GND) DECODER-09-16.5(E2#) DECODER-09-16.8(GND) ENCODER-01-08.8(GND) ENCODER-09-16.5(EI) ENCODER-09-16.8(GND) H3.1 H4.1 P1.1 P1.2 P2.1 P2.2 PROG-BUTTON.3 PROG-BUTTON.4 U1.1(GND/ADJ) U3.3(GND) U3.5(GND) U3.21(GND) U5.7(GND) U6.7(GND) U8.7(GND) U11.4(GND) U12.8(E) USB1.5(GND) USB1.6 USB2.6 X2.2(GND) X2.4(GND)
AND-01-A0: ENCODER-01-08.9(A0) U5.1(1A)
AND-01-A1: ENCODER-01-08.7(A1) U5.4(2A)
AND-01-A2: ENCODER-01-08.6(A2) U5.9(3A)
AND-02-A0: ENCODER-09-16.9(A0) U5.2(1B)
AND-02-A1: ENCODER-09-16.7(A1) U5.5(2B)
AND-02-A2: ENCODER-09-16.6(A2) U5.10(3B)
AREF: CAP-4-ANALOG-REF.1 U3.20(AREF)
BTN-01: ENCODER-01-08.10(0) H7.1 RN11.4
BTN-02: ENCODER-01-08.11(1) H7.2 RN11.3
BTN-03: ENCODER-01-08.12(2) H7.3 RN11.2
BTN-04: ENCODER-01-08.13(3) H7.4 RN11.1
BTN-05: ENCODER-01-08.1(4) H7.5 RN12.4
BTN-06: ENCODER-01-08.2(5) H7.6 RN12.3
BTN-07: ENCODER-01-08.3(6) H7.7 RN12.2
BTN-08: ENCODER-01-08.4(7) H7.8 RN12.1
BTN-09: ENCODER-09-16.10(0) H8.1 RN13.4
BTN-10: ENCODER-09-16.11(1) H8.2 RN13.3
BTN-11: ENCODER-09-16.12(2) H8.3 RN13.2
BTN-12: ENCODER-09-16.13(3) H8.4 RN13.1
BTN-13: ENCODER-09-16.1(4) H8.5 RN14.4
BTN-14: ENCODER-09-16.2(5) H8.6 RN14.3
BTN-15: ENCODER-09-16.3(6) H8.7 RN14.2
BTN-16: ENCODER-09-16.4(7) H8.8 RN14.1
COIN: H4.2 RN2.1 U3.32(PD2(INT0/PCINT18))
CONFIG: PROG-BUTTON.1 PROG-BUTTON.2 RN2.2 U3.1((PCINT19/OC2B/INT1)PD3)
DISP-SCL: H3.4 R5.1 RN1.4
DISP-SDA: H3.3 R6.1 RN1.3
ENABLE-OUT: DECODER-01-08.6(E3) DECODER-09-16.6(E3) U3.9((PCINT21/OC0B/T1)PD5) U12.5(5B)
ENC-GS-01: ENCODER-01-08.14(GS) U5.13(4B)
ICSP-MISO: U3.16((PCINT4/MISO)PB4) U6.13(B1) USB2.2(D-)
ICSP-MOSI: RN2.3 U3.15((PCINT3/OC2A/MOSI)PB3) U6.11(B3) USB2.4(ID)
ICSP-RESET: RN2.4 U3.29(PC6(RESET#/PCINT14)) U8.1(1A) USB2.5(GND)
ICSP-SCK: U3.17(PB5(SCK/PCINT5)) U6.12(B2) USB2.3(D+)
INP-00: U3.25(PC2(ADC2/PCINT10)) U5.3(1Y)
INP-01: U3.26(PC3(ADC3/PCINT11)) U5.6(2Y)
INP-02: U3.2((PCINT20/XCK/T0)PD4) U3.23(PC0(ADC0/PCINT8)) U5.8(3Y)
INP-03: ENCODER-01-08.5(EI) ENCODER-09-16.14(GS) ENCODER-09-16.15(EO) U3.24(PC1(ADC1/PCINT9)) U5.12(4A)
INP-ACTIVITY: U3.31(PD1(TXD/PCINT17)) U5.11(4Y) U8.11(5A)
INV-INP-ACTIVITY: U8.10(5Y) U12.1(1B)
OPP-RESET: U6.10(B4) U8.2(1Y)
OUT-00: DECODER-01-08.1(A0) DECODER-09-16.1(A0) U3.14((PCINT2/SS#/OC1B)PB2)
OUT-01: DECODER-01-08.2(A1) DECODER-09-16.2(A1) U3.13((PCINT1/OC1A)PB1)
OUT-02: DECODER-01-08.3(A2) DECODER-09-16.3(A2) U3.12((PCINT0/CLKO/ICP1)PB0)
OUT-03: DECODER-01-08.4(E1#) DECODER-09-16.4(E1#) U3.11((PCINT23/AIN1)PD7)
RELAY-01: DECODER-01-08.15(Y0#) P1.3
RELAY-02: DECODER-01-08.14(Y1#) P1.4
RELAY-03: DECODER-01-08.13(Y2#) P1.5
RELAY-04: DECODER-01-08.12(Y3#) P1.6
RELAY-05: DECODER-01-08.11(Y4#) P1.7
RELAY-06: DECODER-01-08.10(Y5#) P1.8
RELAY-07: DECODER-01-08.9(Y6#) P1.9
RELAY-08: DECODER-01-08.7(Y7#) P1.10
RELAY-09: DECODER-09-16.15(Y0#) P2.3
RELAY-10: DECODER-09-16.14(Y1#) P2.4
RELAY-11: DECODER-09-16.13(Y2#) P2.5
RELAY-12: DECODER-09-16.12(Y3#) P2.6
RELAY-13: DECODER-09-16.11(Y4#) P2.7
RELAY-14: DECODER-09-16.10(Y5#) P2.8
RELAY-15: DECODER-09-16.9(Y6#) P2.9
RELAY-16: DECODER-09-16.7(Y7#) P2.10
SCL: RN1.1 U3.28(PC5(ADC5/SCL/PCINT13)) U11.7(SCLB)
SD-PIN-2: CARD1.2(CD/DAT3) U6.5(A4)
SD-PIN-3: CARD1.3(CMD) U6.4(A3)
SD-PIN-5: CARD1.5(CLK) U6.3(A2)
SD-PIN-7: CARD1.7(DAT0) U6.2(A1)
SDA: RN1.2 U3.27(PC4(ADC4/SDA/PCINT12)) U11.6(SDAB)
XTAL1: CRYSTAL-CAP-1.2 U3.7((PCINT6/XTAL1/TOSC1)PB6) X2.3(OSC2)
XTAL2: CRYSTAL-CAP-2.2 U3.8((PCINT7/XTAL2/TOSC2)PB7) X2.1(OSC1)
Net-(5V-INDICATOR-2): 5V-INDICATOR.2(+) R-4-5V-INDICATOR.2
Net-(12V-INDICATOR-2): 12V-INDICATOR.2(+) R-4-12V-INDICATOR.2
Net-(ENAMEOUTINDICATOR1-1): ENAMEOUTINDICATOR1.1(-) U12.12(5C)
Net-(ENAMEOUTINDICATOR1-2): ENAMEOUTINDICATOR1.2(+) RESFORENAMEOUTINDICATOR1.2
Net-(INPUTACTIVITYINDICATOR-1): INPUTACTIVITYINDICATOR.1(-) U12.16(1C)
Net-(INPUTACTIVITYINDICATOR-2): INPUTACTIVITYINDICATOR.2(+) R-4-1V-INDICATOR.2
Net-(R5-2): R5.2 U11.2(SCLA)
Net-(R6-2): R6.2 U11.3(SDAA)

Not connected (* = marked no-connect by the designer): CARD1 1(DAT2)* 8(DAT1)* 9(CD)*; ENCODER-01-08 15(EO)*; U3 10((PCINT22/OC0A/AIN0)PD6)* 19(ADC6)* 22(ADC7)*; U6 6(NC)* 9(NC)*; U8 3(2A)* 4(2Y)* 5(3A)* 6(3Y)* 8(4Y)* 9(4A)* 12(6Y)* 13(6A)*; U12 2(2B)* 3(3B)* 4(4B)* 6(6B)* 7(7B)* 9(COM)* 10(7C)* 11(6C)* 13(4C)* 14(3C)* 15(2C)*; USB1 2(D-)* 3(D+)* 4(ID)*

## Notes on the sheets
sheet 1
- CIRCUIT CRYSYAL
sheet 2
- RELAY TERMINALS
sheet 3
- CD4532BE
sheet 4
- VARIABLES
- POWER INDICATOR
- DECOUPLING CAPACITOR
